# Altium project HYDRA_V4_RECOVERY.PrjPcb (part 1 of 2)
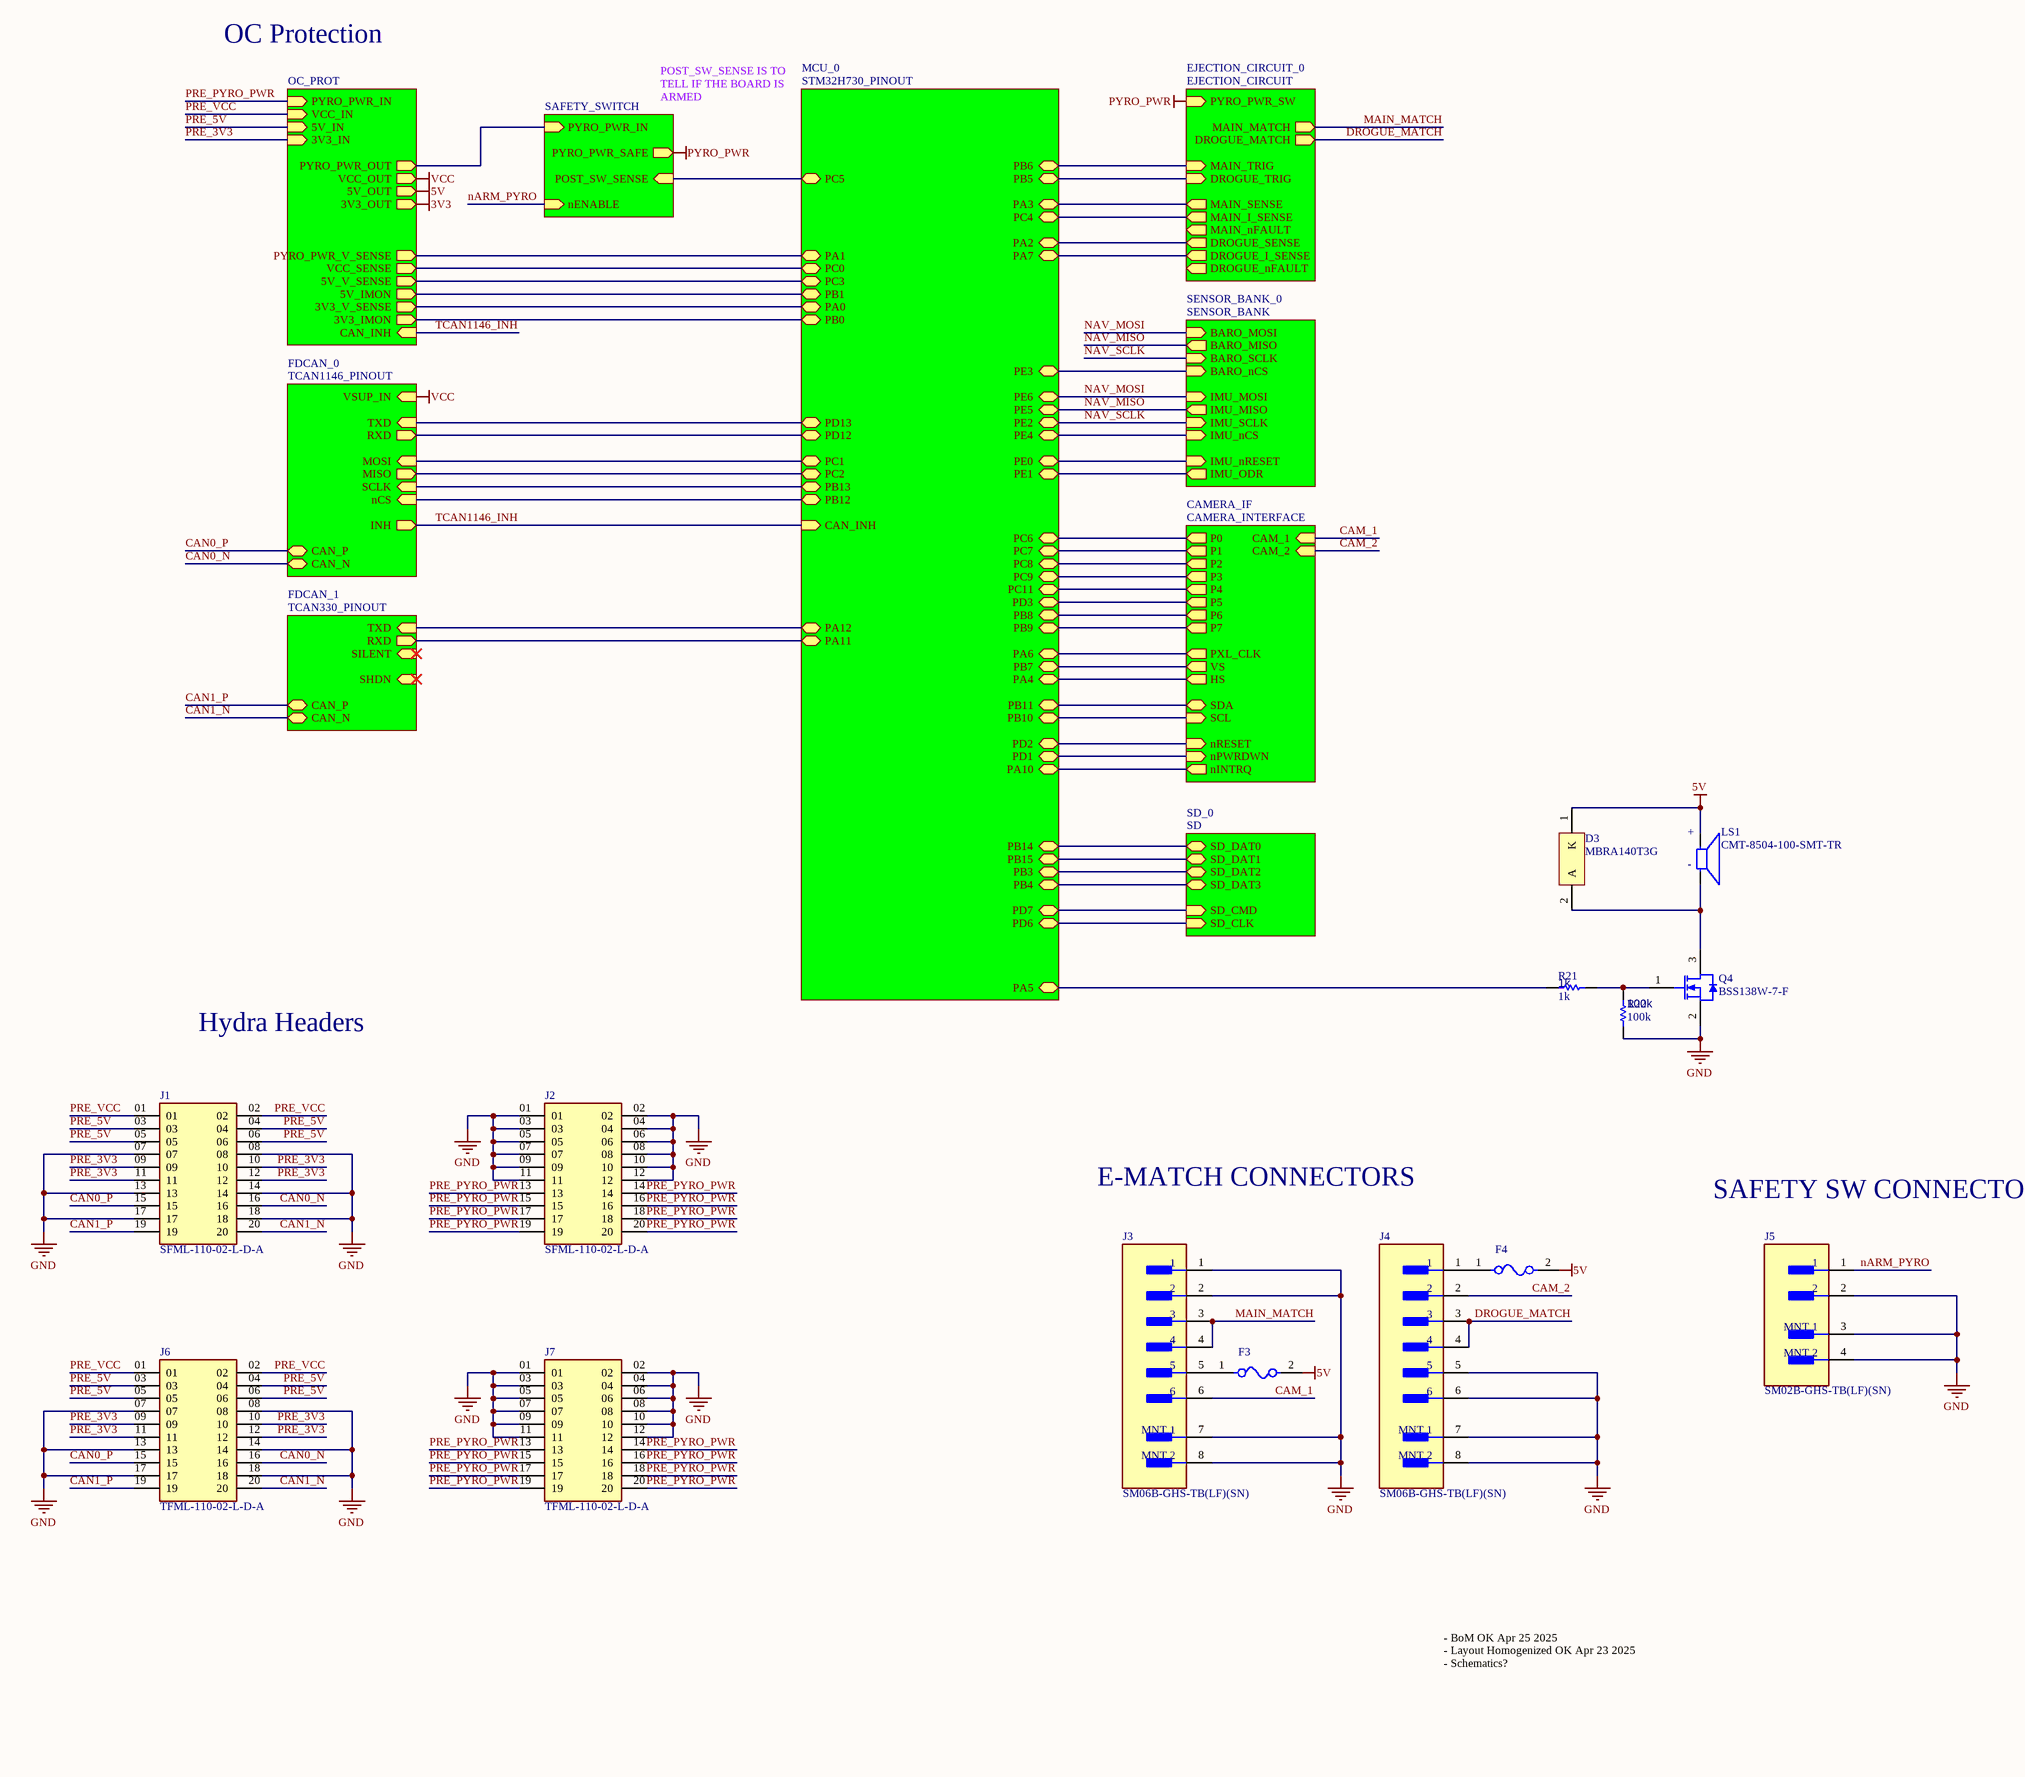
[diagram p0: HYDRA_V4_RECOVERY.SchDoc]
10 sheets, 185 parts. Net scope: hierarchical (ports join the sheet entries above them; power ports are global).
Board file: HYDRA_V4_RECOVERY.PcbDoc
Sheets:
  HYDRA_V4_RECOVERY.SchDoc
    OC_PROT = OC_PROT.SchDoc
    MCU_0 = STM32H730_PINOUT.SchDoc
    EJECTION_CIRCUIT_0 = EJECTION_CIRCUIT.SchDoc
    SENSOR_BANK_0 = SENSOR_BANK.SchDoc
    CAMERA_IF = CAMERA_INTERFACE.SchDoc
    FDCAN_1 = TCAN330_PINOUT.SchDoc
    FDCAN_0 = TCAN1146_PINOUT.SchDoc
    SAFETY_SWITCH_0 = SAFETY_SWITCH.SchDoc
    SD_0 = SD.SchDoc

## Sheet HYDRA_V4_RECOVERY.SchDoc
size C; SheetNumber: 1; SheetTotal: 10

### Parts
D3  MBRA140T3G  [ONSC-SMA-2-403D-02_V]
F3  MF-FSMF050X-2  [FP-MF-FSMF-MFG]  (value not drawn)
F4  MF-FSMF050X-2  [FP-MF-FSMF-MFG]  (value not drawn)
J1  SFML-110-02-L-D-A  [SFML-110-02-L-D-A-Footprint-1]
J2  SFML-110-02-L-D-A  [SFML-110-02-L-D-A-Footprint-1]
J3  SM06B-GHS-TB(LF)(SN)  [FP-SM06B-GHS-TB_LF_SN-MFG]
J4  SM06B-GHS-TB(LF)(SN)  [FP-SM06B-GHS-TB_LF_SN-MFG]
J5  SM02B-GHS-TB(LF)(SN)  [FP-SM02B-GHS-TB_LF_SN-MFG]
J6  TFML-110-02-L-D-A  [TFML-110-02-L-D-A-Footprint-1]
J7  TFML-110-02-L-D-A  [TFML-110-02-L-D-A-Footprint-1]
LS1  CMT-8504-100-SMT-TR  [CMT-8504-100-SMT-TR-Footprint-1]
Q4  BSS138W-7-F  [DIOD-SOT323-3_V]
R21  1k  [R0603B]
R22  100k  [R0603B]

### Sub-sheets
CAMERA_IF = CAMERA_INTERFACE: P0 (out), P1 (out), P2 (out), P3 (out), P4 (out), P5 (out), P6 (out), P7 (out), PXL_CLK (out), VS (out), HS (out), SDA (bidir), SCL (in), nRESET (in), nPWRDWN (in), CAM_1 (in), CAM_2 (in), nINTRQ (out)
EJECTION_CIRCUIT_0 = EJECTION_CIRCUIT: MAIN_TRIG (in), DROGUE_TRIG (in), PYRO_PWR_SW (in), MAIN_SENSE (out), DROGUE_SENSE (out), MAIN_I_SENSE (out), DROGUE_I_SENSE (out), MAIN_MATCH (out), DROGUE_MATCH (out), MAIN_nFAULT (out), DROGUE_nFAULT (out)
FDCAN_0 = TCAN1146_PINOUT: TXD (in), RXD (out), MOSI (in), MISO (out), SCLK (in), nCS (in), INH (out), CAN_P (bidir), CAN_N (bidir), VSUP_IN (in)
FDCAN_1 = TCAN330_PINOUT: TXD (in), RXD (out), SHDN (in), SILENT (in), CAN_P (bidir), CAN_N (bidir)
MCU_0 = STM32H730_PINOUT: CAN_INH (in), PD3 (bidir), PA4 (bidir), PA6 (bidir), PB7 (bidir), PB8 (bidir), PB9 (bidir), PC6 (bidir), PC7 (bidir), PC8 (bidir), PC9 (bidir), PC11 (bidir), PE2 (bidir), PE4 (bidir), PE5 (bidir), PE6 (bidir), PE3 (bidir), PB12 (bidir), PB13 (bidir), PB14 (bidir), PB15 (bidir), PD12 (bidir), PD13 (bidir), PA11 (bidir), PA12 (bidir), PD6 (bidir), PD7 (bidir), PB4 (bidir), PB3 (bidir), PC2 (bidir), PC1 (bidir), PB10 (bidir), PB11 (bidir), PD1 (bidir), PD2 (bidir), PE0 (bidir), PE1 (bidir), PC0 (bidir), PC3 (bidir), PA0 (bidir), PA1 (bidir), PA2 (bidir), PA3 (bidir), PB1 (bidir), PB0 (bidir), PC4 (bidir), PC5 (bidir), PB5 (bidir), PB6 (bidir), PA7 (bidir), PA5 (bidir), PA10 (bidir)
OC_PROT = OC_PROT: PYRO_PWR_IN (in), PYRO_PWR_V_SENSE (out), VCC_SENSE (out), 3V3_IMON (out), CAN_INH (in), VCC_IN (in), 5V_IN (in), 3V3_IN (in), PYRO_PWR_OUT (out), VCC_OUT (out), 5V_OUT (out), 3V3_OUT (out), 3V3_V_SENSE (out), 5V_V_SENSE (out), 5V_IMON (out)
SAFETY_SWITCH_0 = SAFETY_SWITCH: PYRO_PWR_IN (in), PYRO_PWR_SAFE (out), nENABLE (in), POST_SW_SENSE (in)
SD_0 = SD: SD_DAT0 (bidir), SD_DAT1 (bidir), SD_DAT2 (bidir), SD_DAT3 (bidir), SD_CMD (in), SD_CLK (in)
SENSOR_BANK_0 = SENSOR_BANK: IMU_MOSI (in), IMU_MISO (out), IMU_ODR (out), IMU_nCS (in), IMU_SCLK (in), IMU_nRESET (in), BARO_SCLK (in), BARO_MOSI (in), BARO_MISO (out), BARO_nCS (in)

### Nets
5V: D3.1(K) F3.2 F4.2 LS1.P ; sheet OC_PROT/5V_OUT
GND: J1.07 J1.08 J1.13 J1.14 J1.17 J1.18 J2.01 J2.02 J2.03 J2.04 J2.05 J2.06 J2.07 J2.08 J2.09 J2.10 J2.11 J2.12 J3.1 J3.2 J3.7(MNT_1) J3.8(MNT_2) J4.5 J4.6 J4.7(MNT_1) J4.8(MNT_2) J5.2 J5.3(MNT_1) J5.4(MNT_2) J6.07 J6.08 J6.13 J6.14 J6.17 J6.18 J7.01 J7.02 J7.03 J7.04 J7.05 J7.06 J7.07 J7.08 J7.09 J7.10 J7.11 J7.12 Q4.2(S) R22.2
PYRO_PWR: sheet EJECTION_CIRCUIT_0/PYRO_PWR_SW, sheet SAFETY_SWITCH_0/PYRO_PWR_SAFE  [project net PYRO_PWR_SW]
VCC: sheet OC_PROT/VCC_OUT, sheet FDCAN_0/VSUP_IN  [project net TCAN1146_VSUP]
BARO_nCS: sheet MCU_0/PE3, sheet SENSOR_BANK_0/BARO_nCS
CAM_1: J3.6 ; sheet CAMERA_IF/CAM_1
CAM_2: J4.2 ; sheet CAMERA_IF/CAM_2
CAM_SCL: sheet MCU_0/PB10, sheet CAMERA_IF/SCL
CAM_SDA: sheet MCU_0/PB11, sheet CAMERA_IF/SDA
CAN0_N: J1.16 J6.16 ; sheet FDCAN_0/CAN_N
CAN0_P: J1.15 J6.15 ; sheet FDCAN_0/CAN_P
CAN1_N: J1.20 J6.20 ; sheet FDCAN_1/CAN_N
CAN1_P: J1.19 J6.19 ; sheet FDCAN_1/CAN_P
DROGUE_I_SENSE: sheet MCU_0/PA7, sheet EJECTION_CIRCUIT_0/DROGUE_I_SENSE
DROGUE_MATCH: J4.3 J4.4 ; sheet EJECTION_CIRCUIT_0/DROGUE_MATCH
DROGUE_TRIG: sheet MCU_0/PB5, sheet EJECTION_CIRCUIT_0/DROGUE_TRIG
DROGUE_V_SENSE: sheet MCU_0/PA2, sheet EJECTION_CIRCUIT_0/DROGUE_SENSE
HS: sheet MCU_0/PA4, sheet CAMERA_IF/HS
IMU_nCS: sheet MCU_0/PE4, sheet SENSOR_BANK_0/IMU_nCS
IMU_nRESET: sheet MCU_0/PE0, sheet SENSOR_BANK_0/IMU_nRESET
IMU_ODR: sheet MCU_0/PE1, sheet SENSOR_BANK_0/IMU_ODR
LLC: sheet MCU_0/PA6, sheet CAMERA_IF/PXL_CLK
MAIN_I_SENSE: sheet MCU_0/PC4, sheet EJECTION_CIRCUIT_0/MAIN_I_SENSE
MAIN_MATCH: J3.3 J3.4 ; sheet EJECTION_CIRCUIT_0/MAIN_MATCH
MAIN_TRIG: sheet MCU_0/PB6, sheet EJECTION_CIRCUIT_0/MAIN_TRIG
MAIN_V_SENSE: sheet MCU_0/PA3, sheet EJECTION_CIRCUIT_0/MAIN_SENSE
nARM_PYRO: J5.1 ; sheet SAFETY_SWITCH_0/nENABLE
NAV_MISO: sheet MCU_0/PE5, sheet SENSOR_BANK_0/IMU_MISO, sheet SENSOR_BANK_0/BARO_MISO  [project net BARO_MISO]
NAV_MOSI: sheet MCU_0/PE6, sheet SENSOR_BANK_0/IMU_MOSI, sheet SENSOR_BANK_0/BARO_MOSI  [project net BARO_MOSI]
NAV_SCLK: sheet MCU_0/PE2, sheet SENSOR_BANK_0/IMU_SCLK, sheet SENSOR_BANK_0/BARO_SCLK  [project net BARO_SCLK]
nINTRQ: sheet MCU_0/PA10, sheet CAMERA_IF/nINTRQ
nPWRDWN: sheet MCU_0/PD1, sheet CAMERA_IF/nPWRDWN
nRESET: sheet MCU_0/PD2, sheet CAMERA_IF/nRESET
P0: sheet MCU_0/PC6, sheet CAMERA_IF/P0
P1: sheet MCU_0/PC7, sheet CAMERA_IF/P1
P2: sheet MCU_0/PC8, sheet CAMERA_IF/P2
P3: sheet MCU_0/PC9, sheet CAMERA_IF/P3
P4: sheet MCU_0/PC11, sheet CAMERA_IF/P4
P5: sheet MCU_0/PD3, sheet CAMERA_IF/P5
P6: sheet MCU_0/PB8, sheet CAMERA_IF/P6
P7: sheet MCU_0/PB9, sheet CAMERA_IF/P7
PRE_3V3: J1.09 J1.10 J1.11 J1.12 J6.09 J6.10 J6.11 J6.12 ; sheet OC_PROT/3V3_IN
PRE_5V: J1.03 J1.04 J1.05 J1.06 J6.03 J6.04 J6.05 J6.06 ; sheet OC_PROT/5V_IN
PRE_PYRO_PWR: J2.13 J2.14 J2.15 J2.16 J2.17 J2.18 J2.19 J2.20 J7.13 J7.14 J7.15 J7.16 J7.17 J7.18 J7.19 J7.20 ; sheet OC_PROT/PYRO_PWR_IN
PRE_VCC: J1.01 J1.02 J6.01 J6.02 ; sheet OC_PROT/VCC_IN
SD_CLK: sheet MCU_0/PD6, sheet SD_0/SD_CLK
SD_CMD: sheet MCU_0/PD7, sheet SD_0/SD_CMD
SD_DAT0: sheet MCU_0/PB14, sheet SD_0/SD_DAT0
SD_DAT1: sheet MCU_0/PB15, sheet SD_0/SD_DAT1
SD_DAT2: sheet MCU_0/PB3, sheet SD_0/SD_DAT2
SD_DAT3: sheet MCU_0/PB4, sheet SD_0/SD_DAT3
TCAN1146_INH: sheet OC_PROT/CAN_INH, sheet MCU_0/CAN_INH, sheet FDCAN_0/INH  [project net PRE_ZENER_CAN_INH]
VS: sheet MCU_0/PB7, sheet CAMERA_IF/VS
NetD3_2: D3.2(A) LS1.N Q4.3(D)
NetF3_1: F3.1 J3.5
NetF4_1: F4.1 J4.1
NetF7_2: sheet OC_PROT/PYRO_PWR_OUT, sheet SAFETY_SWITCH_0/PYRO_PWR_IN
NetQ4_1: Q4.1(G) R21.1 R22.1
NetR21_2: R21.2 ; sheet MCU_0/PA5
NetR23_1: sheet OC_PROT/VCC_SENSE, sheet MCU_0/PC0
NetR25_1: sheet OC_PROT/PYRO_PWR_V_SENSE, sheet MCU_0/PA1
NetR27_1: sheet OC_PROT/5V_V_SENSE, sheet MCU_0/PC3
NetR31_1: sheet OC_PROT/3V3_V_SENSE, sheet MCU_0/PA0
NetR33_1: sheet OC_PROT/3V3_IMON, sheet MCU_0/PB0
NetR41_1: sheet MCU_0/PC5, sheet SAFETY_SWITCH_0/POST_SW_SENSE
NetR79_1: sheet OC_PROT/5V_IMON, sheet MCU_0/PB1
NetU8_16: sheet MCU_0/PC1, sheet FDCAN_0/MOSI
NetU8_17: sheet MCU_0/PC2, sheet FDCAN_0/MISO
NetU8_51: sheet MCU_0/PB12, sheet FDCAN_0/nCS
NetU8_52: sheet MCU_0/PB13, sheet FDCAN_0/SCLK
NetU8_59: sheet MCU_0/PD12, sheet FDCAN_0/RXD
NetU8_60: sheet MCU_0/PD13, sheet FDCAN_0/TXD
NetU8_70: sheet MCU_0/PA11, sheet FDCAN_1/RXD
NetU8_71: sheet MCU_0/PA12, sheet FDCAN_1/TXD

### Notes on the sheet
- OC Protection
- POST_SW_SENSE IS TO TELL IF THE BOARD IS ARMED
- Hydra Headers
- E-MATCH CONNECTORS
- SAFETY SW CONNECTOR
- - BoM OK Apr 25 2025
  - Layout Homogenized OK Apr 23 2025
  - Schematics?
- (in symbol CMP-00030-00002-1) +; -

### Library data of the parts
D3 = CMP-1055-00320-1: Schottky Power Rectifier, 2-Pin SMA, Pb-Free, Tape and Reel; Manufacturer: On Semiconductor; Configuration: Single; IFSM Max (A): 30; PackageReference: SMA-2-403D-02; PackageDescription: 2-Pin Small Molded Package, J-Bend Lead, Body 2.605 x 4.315 mm; RoHS: TRUE; ComponentLink1Description: Manufacturer URL; Packing: Tape and Reel; ComponentLink3URL: http://www.onsemi.com/pub_link/Collateral/403D-02.PDF; ComponentLink2Description: Datasheet; ComponentLink2URL: http://www.onsemi.cn/pub_link/Collateral/MBRA140T3-D.PDF; DatasheetVersion: Rev. 10; ComponentLink1URL: http://www.onsemi.com/; PartNumber: MBRA140T3G; ComponentLink3Description: Package Specification; Mounting Technology: Surface Mount; PackageVersion: Rev. G, 07/2012
F3 F4 = CMP-07400-000010-1: PTC RESET FUSE 6V 500MA 0603; Manufacturer: Bourns Inc.; Trip Current: 1A; Current Rating: 40A; Hold Current: 0.5A; Resistance: 0.1-0.8Ω; Value: 0.1-0.8Ω; Trip Time: 0.1s; Mouser Description: Resettable Fuses - PPTC 6volts 40amps; Category: Fuse; Digikey Description: PTC RESET FUSE 6V 500MA 0603; Temperature: -40°C to +85°C; Device Class L3: unset; Automotive: No; RoHS: TRUE; Ambient Temperature Range High: +85°C; Device Class L2: PTC Resettable Fuses; Temperature Range High: +85°C; Voltage Rating: 6V; Package: MF-FSMF; Manufacturer Part Number: MF-FSMF050X-2; Ambient Temperature Range Low: -40°C; Lead Free: Yes; ComponentLink2Description: Datasheet; Octopart: https://octopart.com/mf-fsmf050x-2-bourns-10470804; ComponentLink2URL: https://www.bourns.com/docs/Product-Datasheets/mffsmf.pdf; Temperature Range Low: -40°C; Height: 1mm; Device Class L1: Circuit Protection
J1 J2 = CMP-002-00043-1: Board Connector, 20 Contact(s), 2 Row(s), Female, Straight, 0.05 inch Pitch, Surface Mount Terminal, Locking, Black Insulator, Socket; RoHS Compliant: Yes; Connector Type: BOARD CONNECTOR; Mounting Technology: Board
J3 J4 = CMP-002-00082-1: Conn Shrouded Header HDR 6 POS 1.25mm Solder RA Side Entry SMD T/R
J5 = CMP-002-00083-1: MCU 32-bit LPC1800 ARM Cortex M3 RISC 768KB Flash 3.3V 100-Pin TFBGA Tray
J6 J7 = CMP-002-00042-3: Board Connector, 20 Contact(s), 2 Row(s), Male, Straight, Surface Mount Terminal; Connector Type: BOARD CONNECTOR; Mounting Technology: Board; RoHS Compliant: Yes
LS1 = CMP-00030-00002-1: 8.5 mm, 5 Vo-p, 100 dB, Surface Mount (SMT), Magnetic Audio Transducer Buzzer
Q4 = CMP-2000-05968-1: N-Channel Enhancement Mode Mosfet, 50 V, 200 mA, -55 to 150 degC, 6-Pin SOT-323, RoHS, Tape and Reel; Typical Turn-Off Delay Time: 20ns; Number of Channels: 1Channel; Type: EnhancementModeFieldEffectTransistor; Brand: DiodesIncorporated; Vds - Drain-Source Breakdown Voltage: 75V; Vgs - Gate-Source Voltage: 20V; Rds On - Drain-Source Resistance: 1.4Ohms; Transistor Type: 1N-Channel; Configuration: Single; Unit Weight: 0.000212oz; Pd - Power Dissipation: 200mW; Id - Continuous Drain Current: 200mA; Forward Transconductance - Min: 0.1S; Manufacturer URL: http://www.diodes.com/; Series: BSS138; Package Description: 3-Pin Small Outline Transistor, Body 2 x 1.25 mm, Pitch 0.65 mm; Mounting Technology: SurfaceMount; Product Category: MOSFET; RoHS: True; Maximum Operating Temperature: +150C; Height: 1mm; Length: 2.2mm; Technology: Si; Width: 1.35mm; Datasheet URL: http://www.diodes.com/_files/datasheets/ds30206.pdf; Manufacturer: DiodesIncorporated; Package / Case: SOT-323-3; Typical Turn-On Delay Time: 20ns; Transistor Polarity: N-Channel; Factory Pack Quantity: 3000; Packaging: Reel; Product: MOSFETSmallSignal; Datasheet Version: Rev. 11-2, 09/2013; Package Reference: SOT323; Minimum Operating Temperature: -55C; Mounting Style: SMD/SMT; Channel Mode: Enhancement
R21 R22 = CMP-009-00002-14: Resistor
  R21: Value: 1k
  R22: Value: 100k

## Sheet OC_PROT.SchDoc
size C; SheetNumber: 3; SheetTotal: 10
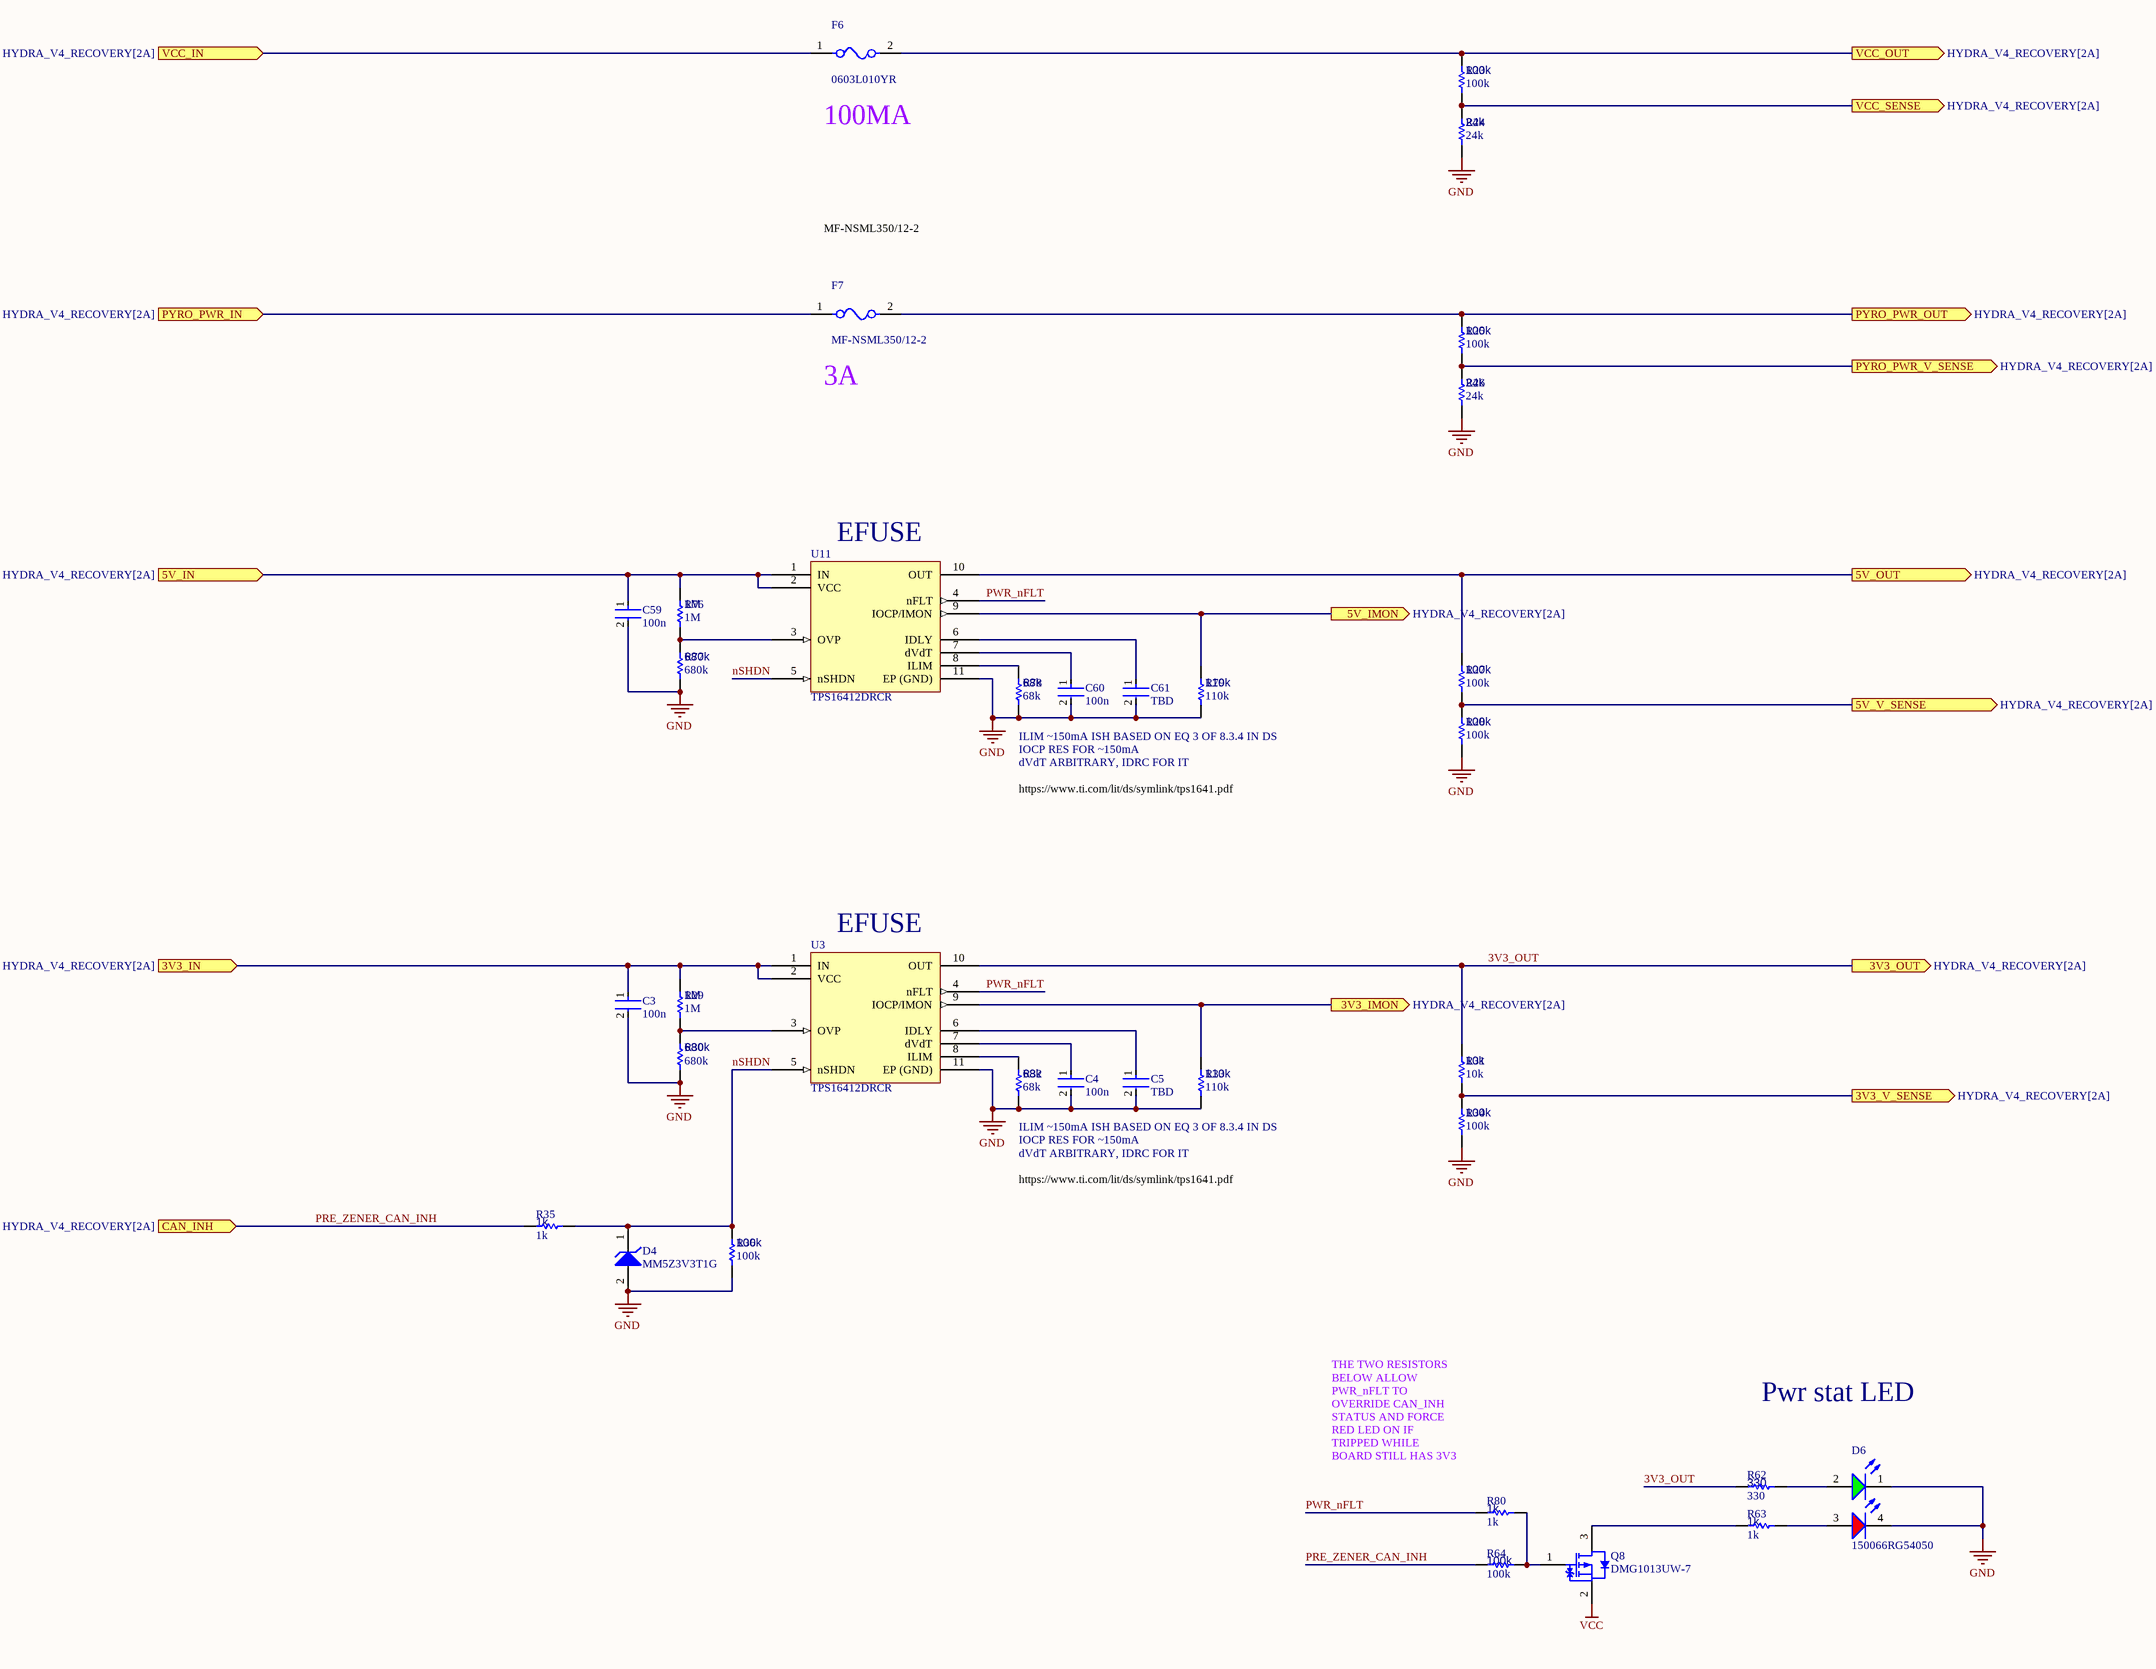
[diagram p1: OC_PROT.SchDoc]

### Parts
C3  100n  [FP-0402-L_1_0_0_05-W_0_5-IPC_A]
C4  100n  [FP-0402-L_1_0_0_05-W_0_5-IPC_A]
C5  TBD  [FP-0402-L_1_0_0_05-W_0_5-IPC_A]
C59  100n  [FP-0402-L_1_0_0_05-W_0_5-IPC_A]
C60  100n  [FP-0402-L_1_0_0_05-W_0_5-IPC_A]
C61  TBD  [FP-0402-L_1_0_0_05-W_0_5-IPC_A]
D4  MM5Z3V3T1G  [ONSC-SOD-523-2-502-01_V]
D6  150066RG54050  [WL-SBCD_0606]
F6  0603L010YR  [FP-0603L-MFG]
F7  MF-NSML350/12-2  [FP-MF-NSMF012-2-MFG]
Q8  DMG1013UW-7  [DIOD-SOT323-3_V]
R23  100k  [R0603B]
R24  24k  [R0603B]
R25  100k  [R0603B]
R26  24k  [R0603B]
R27  100k  [R0603B]
R28  100k  [R0603B]
R29  1M  [R0603B]
R30  680k  [R0603B]
R31  10k  [R0603B]
R32  68k  [R0603B]
R33  110k  [R0603B]
R34  100k  [R0603B]
R35  1k  [R0603B]
R36  100k  [R0603B]
R62  330  [R0603B]
R63  1k  [R0603B]
R64  100k  [R0603B]
R76  1M  [R0603B]
R77  680k  [R0603B]
R78  68k  [R0603B]
R79  110k  [R0603B]
R80  1k  [R0603B]
U3  TPS16412DRCR  [PSON50P300X100_HS-11N]
U11  TPS16412DRCR  [PSON50P300X100_HS-11N]

### Ports
3V3_IMON (out, see HYDRA_V4_RECOVERY[2A]), 3V3_IN (in, see HYDRA_V4_RECOVERY[2A]), 3V3_OUT (out, see HYDRA_V4_RECOVERY[2A]), 3V3_V_SENSE (out, see HYDRA_V4_RECOVERY[2A]), 5V_IMON (out, see HYDRA_V4_RECOVERY[2A]), 5V_IN (in, see HYDRA_V4_RECOVERY[2A]), 5V_OUT (out, see HYDRA_V4_RECOVERY[2A]), 5V_V_SENSE (out, see HYDRA_V4_RECOVERY[2A]), CAN_INH (in, see HYDRA_V4_RECOVERY[2A]), PYRO_PWR_IN (in, see HYDRA_V4_RECOVERY[2A]), PYRO_PWR_OUT (out, see HYDRA_V4_RECOVERY[2A]), PYRO_PWR_V_SENSE (out, see HYDRA_V4_RECOVERY[2A]), VCC_IN (in, see HYDRA_V4_RECOVERY[2A]), VCC_OUT (out, see HYDRA_V4_RECOVERY[2A]), VCC_SENSE (out, see HYDRA_V4_RECOVERY[2A])

### Nets
3V3_OUT: R31.2 R62.2 U3.10(OUT) ; port 3V3_OUT
5V: R27.2 U11.10(OUT) ; port 5V_OUT
GND: C3.2 C4.2 C5.2 C59.2 C60.2 C61.2 D4.2(A) D6.1(K) D6.4(K) R24.1 R26.1 R28.1 R30.2 R32.2 R33.2 R34.1 R36.1 R77.2 R78.2 R79.2 U3.11(EP_(GND)) U11.11(EP_(GND))
VCC: F6.2 Q8.2(S) R23.2 ; port VCC_OUT  [project net TCAN1146_VSUP]
nSHDN: D4.1(K) R35.1 R36.2 U3.5(nSHDN) U11.5(nSHDN)
PRE_3V3: C3.1 R29.1 U3.1(IN) U3.2(VCC) ; port 3V3_IN
PRE_5V: C59.1 R76.1 U11.1(IN) U11.2(VCC) ; port 5V_IN
PRE_PYRO_PWR: F7.1 ; port PYRO_PWR_IN
PRE_VCC: F6.1 ; port VCC_IN
PRE_ZENER_CAN_INH: R35.2 R64.2 ; port CAN_INH
PWR_nFLT: R80.2 U3.4(nFLT) U11.4(nFLT)
NetC4_1: C4.1 U3.7(dVdT)
NetC5_1: C5.1 U3.6(IDLY)
NetC60_1: C60.1 U11.7(dVdT)
NetC61_1: C61.1 U11.6(IDLY)
NetD6_2: D6.2(A) R62.1
NetD6_3: D6.3(A) R63.1
NetF7_2: F7.2 R25.2 ; port PYRO_PWR_OUT
NetQ8_1: Q8.1(G) R64.1 R80.1
NetQ8_3: Q8.3(D) R63.2
NetR23_1: R23.1 R24.2 ; port VCC_SENSE
NetR25_1: R25.1 R26.2 ; port PYRO_PWR_V_SENSE
NetR27_1: R27.1 R28.2 ; port 5V_V_SENSE
NetR29_2: R29.2 R30.1 U3.3(OVP)
NetR31_1: R31.1 R34.2 ; port 3V3_V_SENSE
NetR32_1: R32.1 U3.8(ILIM)
NetR33_1: R33.1 U3.9(IOCP/IMON) ; port 3V3_IMON
NetR76_2: R76.2 R77.1 U11.3(OVP)
NetR78_1: R78.1 U11.8(ILIM)
NetR79_1: R79.1 U11.9(IOCP/IMON) ; port 5V_IMON

### Notes on the sheet
- (near F6) 100MA
- MF-NSML350/12-2
- (near F7) 3A
- (near U11) EFUSE
- ILIM ~150mA ISH BASED ON EQ 3 OF 8.3.4 IN DS
- dVdT ARBITRARY, IDRC FOR IT
- IOCP RES FOR ~150mA
- https://www.ti.com/lit/ds/symlink/tps1641.pdf
- (near U3) EFUSE
- Pwr stat LED
- (near R80) THE TWO RESISTORS BELOW ALLOW PWR_nFLT TO OVERRIDE CAN_INH STATUS AND FORCE RED LED ON IF TRIPPED WHILE BOARD STILL HAS 3V3

### Library data of the parts
C3-C5 C59-C61 = CMP-001-00058-1: LARGE PADS, 0402 CAP, CHANGE COMMENT TO MATCH REAL P/N; Capacitor Type: Ceramic; Min Operating Temperature: -55°C; Mounting Technology: Surface Mount; Pins: 2; Case/Package: 0402; RoHS Compliant: Yes; Max Operating Temperature: 85°C
  C3 C4 C59 C60: Value: 100n
  C5 C61: Value: TBD
D4 = CMP-1060-00750-1: Zener Voltage Regulator, 500 mW, 2-Pin SOD-523, Pb-Free, Tape and Reel; Manufacturer: On Semiconductor; P Max (W): 0.5; VZ Typ (V): 3.3; RoHS: Pb-Free; ComponentLink2Description: Datasheet; PackageReference: SOD-523-2-502-01; DatasheetVersion: Rev. 10; ComponentLink1Description: Manufacturer URL; PackageVersion: Rev. E, 09/2010; ComponentLink3URL: http://www.onsemi.com/pub_link/Collateral/502-01.PDF; ComponentLink2URL: http://www.onsemi.cn/pub_link/Collateral/MM5Z2V4T1-D.PDF; Mounting Technology: Surface Mount; PartNumber: MM5Z3V3T1G; Packing: Tape and Reel; PackageDescription: 2-Pin SOD, Body 1.2 x 0.8 mm; ComponentLink1URL: http://www.onsemi.com/; ComponentLink3Description: Package Specification
D6 = CMP-004-00040-2: Led, Red/Grn, 180Mcd/230Mcd, 624Nm/525Nm Rohs Compliant: Yes; Source: rgled.SchLib; Component Type: Standard; Design Item ID: CMP-004-00034-2; Pins: 4
F6 = CMP-08606-000025-1: PTC RESET FUSE 15V 100MA 0603; Manufacturer: Littelfuse Inc; Value: 0.9-6Ω; Trip Time: 1s; Current Rating: 40A; Trip Current: 0.3A; Hold Current: 0.1A; Octopart: https://octopart.com/0603l010yr-littelfuse-8316166; ComponentLink2URL: https://www.littelfuse.com/~/media/electronics/datasheets/resettable_ptcs/littelfuse_ptc_0603l_datasheet.pdf.pdf; Package: 0603L; Category: Fuse; Mouser Description: Resettable Fuses - PPTC PTC 15V 0603 .100A POLY SURF MOUNT; Automotive: No; Resistance: 0.9-6Ω; Device Class L3: unset; Digikey Description: PTC RESET FUSE 15V 100MA 0603; Lead Free: Yes; Temperature: -40°C to +85°C; Ambient Temperature Range High: +85°C; ComponentLink2Description: Datasheet; RoHS: TRUE; Height: 0.75mm; Temperature Range Low: -40°C; Manufacturer Part Number: 0603L010YR; Device Class L2: PTC Resettable Fuses; Device Class L1: Circuit Protection; Temperature Range High: +85°C; Ambient Temperature Range Low: -40°C; Voltage Rating: 15V
F7 = CMP-07400-000025-1: Manufacturer Part Number: MF-NSMF012-2; Manufacturer: Bourns Inc.; Voltage Rating: 30V; Hold Current: 0.12A; Trip Time: 0.2s; Trip Current: 0.29A; Automotive Grade: Grade 3; Resistance: 1.35-8.5Ω; Current Rating: 10A; Value: 1.35-8.5Ω; Category: Fuse; Device Class L2: PTC Resettable Fuses; ComponentLink2URL: https://www.bourns.com/docs/Product-Datasheets/mfnsmf.pdf; Package: MF-NSMF012-2; Automotive: Yes; Temperature Range Low: -40°C; Lead Free: Yes; Digikey Description: PTC RESET FUSE 30V 120MA 1206; Ambient Temperature Range Low: -40°C; Ambient Temperature Range High: +85°C; RoHS: TRUE; Device Class L3: unset; Device Class L1: Circuit Protection; Mouser Description: Resettable Fuses - PPTC 0.12A 30V 1.35ohm; Octopart: https://octopart.com/mf-nsmf012-2-bourns-24569; Temperature Range High: +85°C; ComponentLink2Description: Datasheet; Height: 1.1mm; Temperature: -40°C to +85°C
Q8 = CMP-2000-06170-1: P-Channel Enhancement Mode MOSFET, 310 mW, 20 V, -55 to 150 degC, 3-Pin SOT-323, RoHS, Tape and Reel; Manufacturer: Diodes Inc; Qg Gate Charge: 0.622nC; Drain-Source On Resistance-Max: 750mO; Rated Power Dissipation: 310mW; Drain-to-Source Voltage [Vdss]: 20V; Package Reference: SOT323; Datasheet Version: Rev. 3-2, 09/2013; Package Description: 3-Pin Small Outline Transistor, Body 2 x 1.25 mm, Pitch 0.65 mm; Mounting Technology: SurfaceMount; Manufacturer URL: http://www.diodes.com/; Datasheet URL: http://www.diodes.com/_files/datasheets/ds31861.pdf; Channel Type: P-Channel
R23-R36 R62-R64 R76-R80 = CMP-009-00002-14: Resistor
  R23 R25 R27 R28 R34 R36 R64: Value: 100k
  R24 R26: Value: 24k
  R29 R76: Value: 1M
  R30 R77: Value: 680k
  R31: Value: 10k
  R32 R78: Value: 68k
  R33 R79: Value: 110k
  R35 R63 R80: Value: 1k
  R62: Value: 330
U3 U11 = CMP-019-00048-3: 2.7-V to 40-V 152-mΩ 1.8-A eFuse with output power limiting 10-VSON -40 to 125

## Sheet STM32H730_PINOUT.SchDoc
size C; SheetNumber: 7; SheetTotal: 10
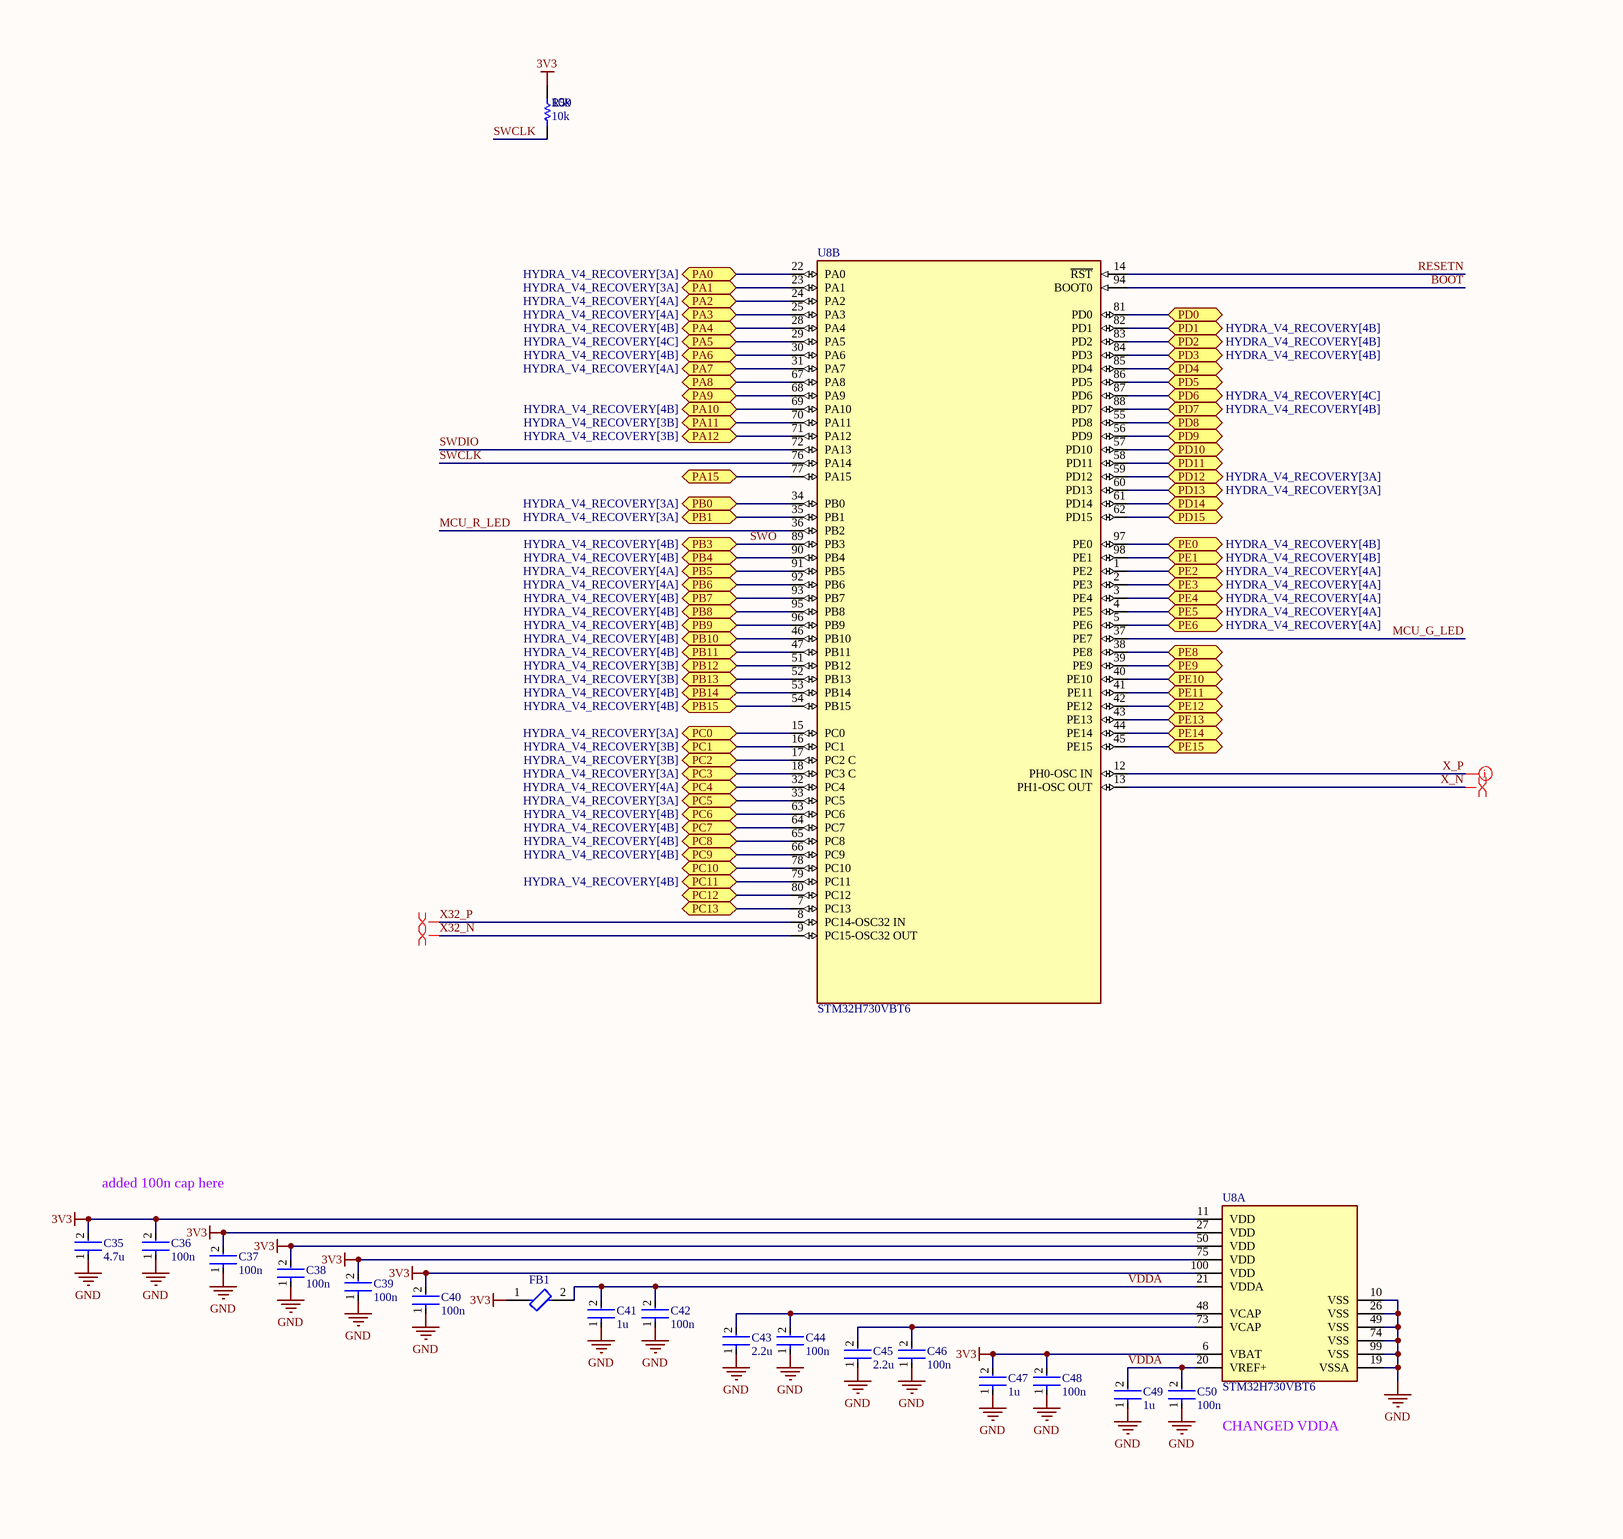
[diagram p2: STM32H730_PINOUT.SchDoc, left]
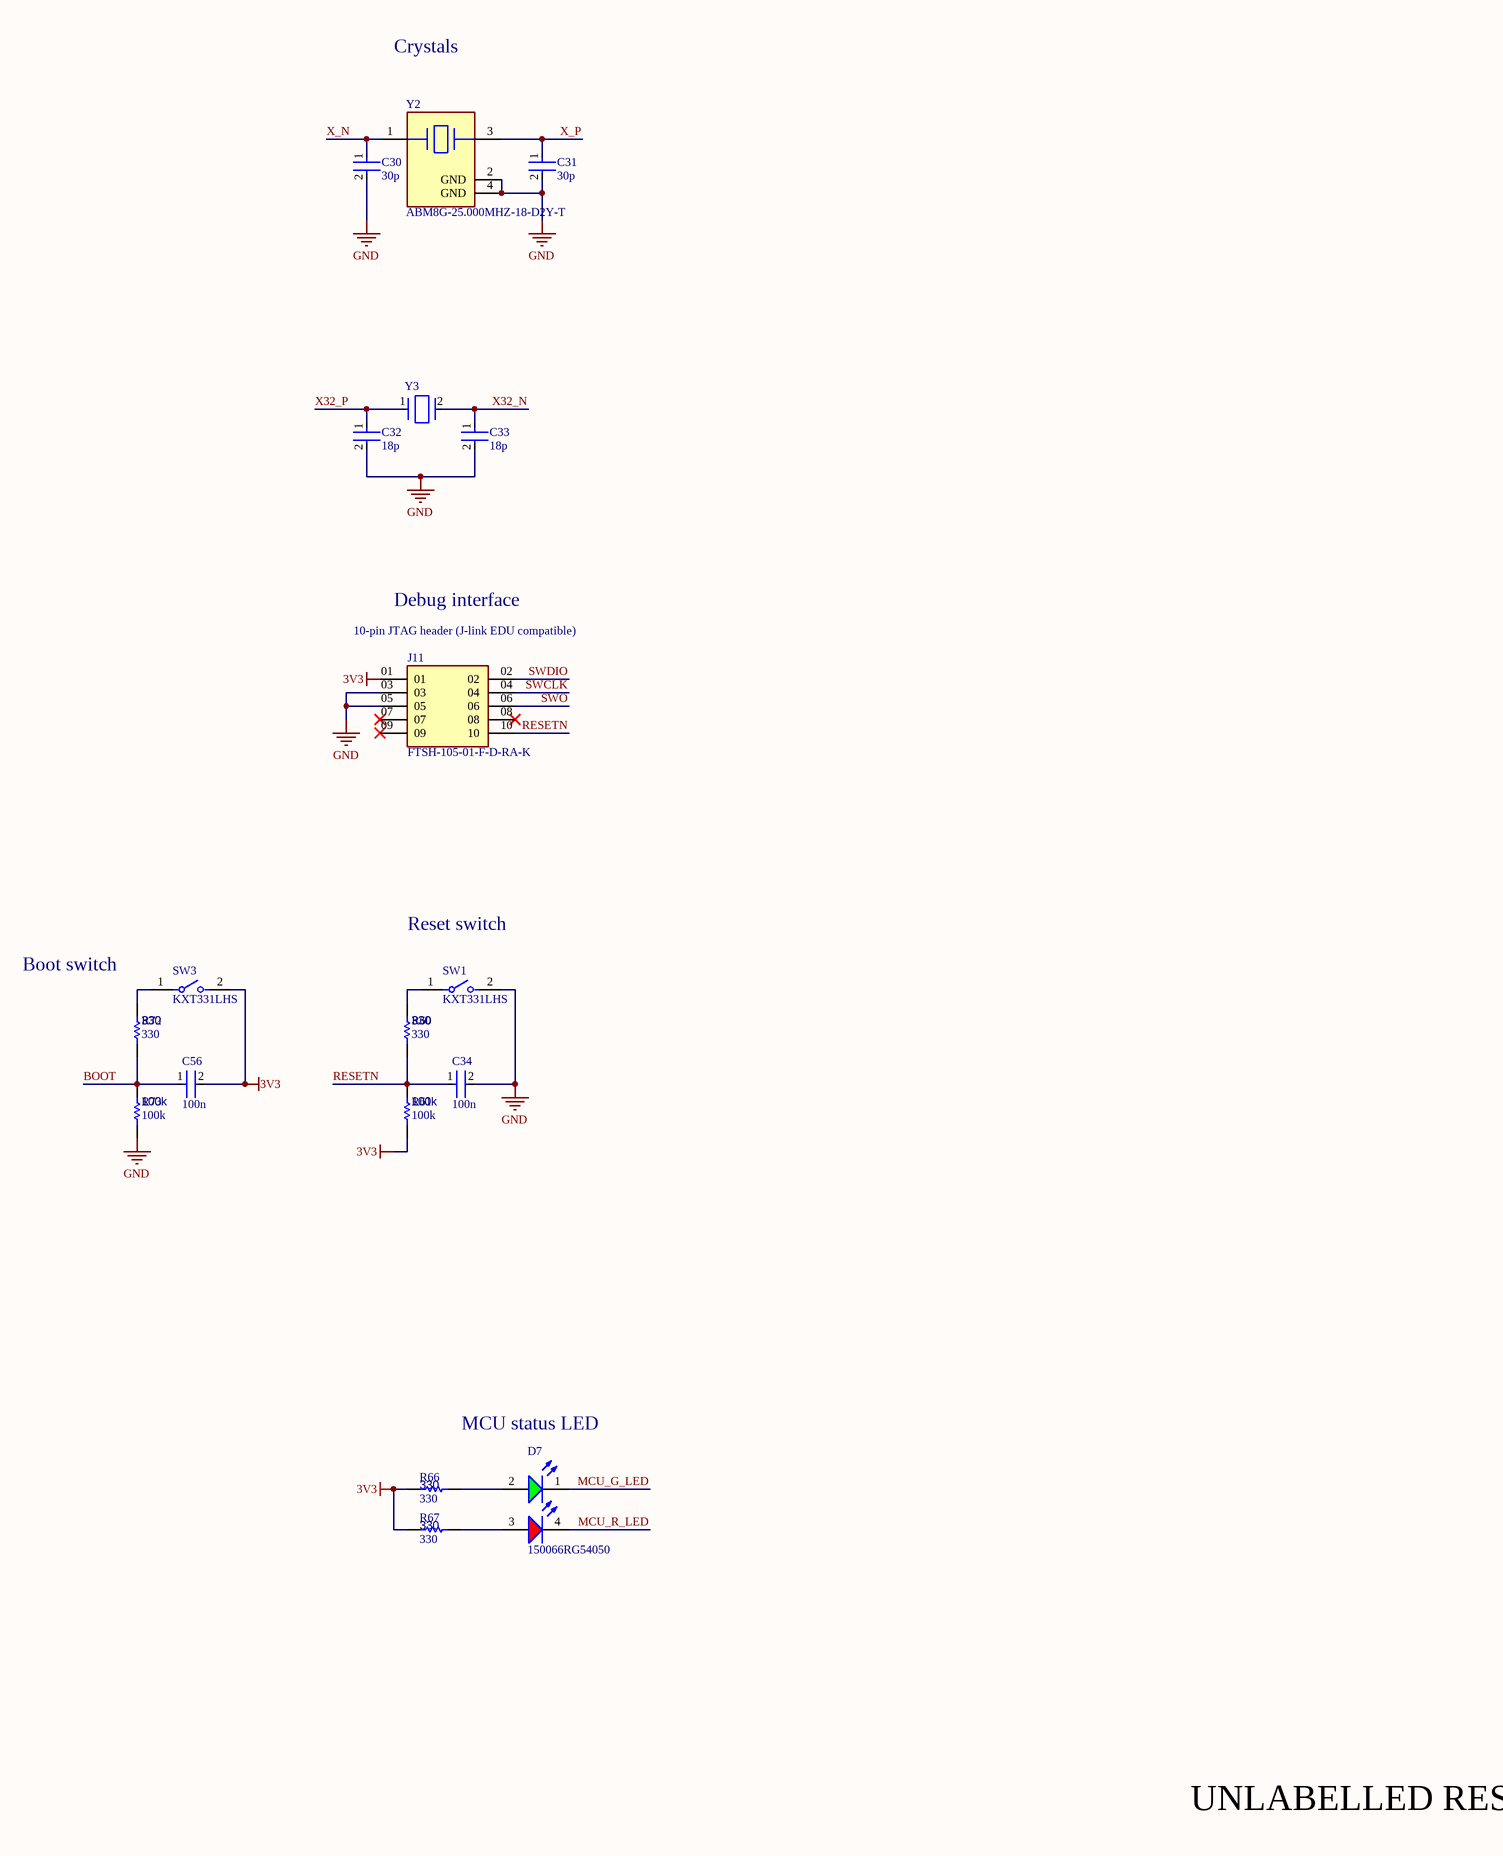
[diagram p3: STM32H730_PINOUT.SchDoc, right]

### Parts
C30  30p  [FP-0402-L_1_0_0_05-W_0_5-IPC_A]
C31  30p  [FP-0402-L_1_0_0_05-W_0_5-IPC_A]
C32  18p  [FP-0402-L_1_0_0_05-W_0_5-IPC_A]
C33  18p  [FP-0402-L_1_0_0_05-W_0_5-IPC_A]
C34  100n  [FP-0402-L_1_0_0_05-W_0_5-IPC_A]
C35  4.7u  [FP-0402-L_1_0_0_05-W_0_5-IPC_A]
C36  100n  [FP-0402-L_1_0_0_05-W_0_5-IPC_A]
C37  100n  [FP-0402-L_1_0_0_05-W_0_5-IPC_A]
C38  100n  [FP-0402-L_1_0_0_05-W_0_5-IPC_A]
C39  100n  [FP-0402-L_1_0_0_05-W_0_5-IPC_A]
C40  100n  [FP-0402-L_1_0_0_05-W_0_5-IPC_A]
C41  1u  [FP-0402-L_1_0_0_05-W_0_5-IPC_A]
C42  100n  [FP-0402-L_1_0_0_05-W_0_5-IPC_A]
C43  2.2u  [FP-0402-L_1_0_0_05-W_0_5-IPC_A]
C44  100n  [FP-0402-L_1_0_0_05-W_0_5-IPC_A]
C45  2.2u  [FP-0402-L_1_0_0_05-W_0_5-IPC_A]
C46  100n  [FP-0402-L_1_0_0_05-W_0_5-IPC_A]
C47  1u  [FP-0402-L_1_0_0_05-W_0_5-IPC_A]
C48  100n  [FP-0402-L_1_0_0_05-W_0_5-IPC_A]
C49  1u  [FP-0402-L_1_0_0_05-W_0_5-IPC_A]
C50  100n  [FP-0402-L_1_0_0_05-W_0_5-IPC_A]
C56  100n  [FP-0402-L_1_0_0_05-W_0_5-IPC_A]
D7  150066RG54050  [WL-SBCD_0606]
FB1  BLM15PX601SN1D  [FP-BLM15-0_05-MFG]  (value not drawn)
J11  FTSH-105-01-F-D-RA-K  [FTSH-105-01-F-D-RA-K-Footprint-1]
R59  10k  [R0603B]
R60  330  [R0603B]
R61  100k  [R0603B]
R66  330  [R0603B]
R67  330  [R0603B]
R72  330  [R0603B]
R73  100k  [R0603B]
SW1  KXT331LHS  [FP-KXT331LHS-MFG]
SW3  KXT331LHS  [FP-KXT331LHS-MFG]
U8  STM32H730VBT6  [FP-LQFP100-1L-IPC_C]  (parts A,B of 2)
Y2  ABM8G-25.000MHZ-18-D2Y-T  [FP-ABM8G-MFG]
Y3  ECS-.327-12.5-1210-TR  [FP-ECX-1210-MFG]  (value not drawn)

### Ports
PA0 (bidir, see HYDRA_V4_RECOVERY[3A]), PA1 (bidir, see HYDRA_V4_RECOVERY[3A]), PA2 (bidir, see HYDRA_V4_RECOVERY[4A]), PA3 (bidir, see HYDRA_V4_RECOVERY[4A]), PA4 (bidir, see HYDRA_V4_RECOVERY[4B]), PA5 (bidir, see HYDRA_V4_RECOVERY[4C]), PA6 (bidir, see HYDRA_V4_RECOVERY[4B]), PA7 (bidir, see HYDRA_V4_RECOVERY[4A]), PA8 (bidir), PA9 (bidir), PA10 (bidir, see HYDRA_V4_RECOVERY[4B]), PA11 (bidir, see HYDRA_V4_RECOVERY[3B]), PA12 (bidir, see HYDRA_V4_RECOVERY[3B]), PA15 (bidir), PB0 (bidir, see HYDRA_V4_RECOVERY[3A]), PB1 (bidir, see HYDRA_V4_RECOVERY[3A]), PB3 (bidir, see HYDRA_V4_RECOVERY[4B]), PB4 (bidir, see HYDRA_V4_RECOVERY[4B]), PB5 (bidir, see HYDRA_V4_RECOVERY[4A]), PB6 (bidir, see HYDRA_V4_RECOVERY[4A]), PB7 (bidir, see HYDRA_V4_RECOVERY[4B]), PB8 (bidir, see HYDRA_V4_RECOVERY[4B]), PB9 (bidir, see HYDRA_V4_RECOVERY[4B]), PB10 (bidir, see HYDRA_V4_RECOVERY[4B]), PB11 (bidir, see HYDRA_V4_RECOVERY[4B]), PB12 (bidir, see HYDRA_V4_RECOVERY[3B]), PB13 (bidir, see HYDRA_V4_RECOVERY[3B]), PB14 (bidir, see HYDRA_V4_RECOVERY[4B]), PB15 (bidir, see HYDRA_V4_RECOVERY[4B]), PC0 (bidir, see HYDRA_V4_RECOVERY[3A]), PC1 (bidir, see HYDRA_V4_RECOVERY[3B]), PC2 (bidir, see HYDRA_V4_RECOVERY[3B]), PC3 (bidir, see HYDRA_V4_RECOVERY[3A]), PC4 (bidir, see HYDRA_V4_RECOVERY[4A]), PC5 (bidir, see HYDRA_V4_RECOVERY[3A]), PC6 (bidir, see HYDRA_V4_RECOVERY[4B]), PC7 (bidir, see HYDRA_V4_RECOVERY[4B]), PC8 (bidir, see HYDRA_V4_RECOVERY[4B]), PC9 (bidir, see HYDRA_V4_RECOVERY[4B]), PC10 (bidir), PC11 (bidir, see HYDRA_V4_RECOVERY[4B]), PC12 (bidir), PC13 (bidir), PD0 (bidir), PD1 (bidir, see HYDRA_V4_RECOVERY[4B]), PD2 (bidir, see HYDRA_V4_RECOVERY[4B]), PD3 (bidir, see HYDRA_V4_RECOVERY[4B]), PD4 (bidir), PD5 (bidir), PD6 (bidir, see HYDRA_V4_RECOVERY[4C]), PD7 (bidir, see HYDRA_V4_RECOVERY[4B]), PD8 (bidir), PD9 (bidir), PD10 (bidir), PD11 (bidir), PD12 (bidir, see HYDRA_V4_RECOVERY[3A]), PD13 (bidir, see HYDRA_V4_RECOVERY[3A]), PD14 (bidir), PD15 (bidir), PE0 (bidir, see HYDRA_V4_RECOVERY[4B]), PE1 (bidir, see HYDRA_V4_RECOVERY[4B]), PE2 (bidir, see HYDRA_V4_RECOVERY[4A]), PE3 (bidir, see HYDRA_V4_RECOVERY[4A]), PE4 (bidir, see HYDRA_V4_RECOVERY[4A]), PE5 (bidir, see HYDRA_V4_RECOVERY[4A]), PE6 (bidir, see HYDRA_V4_RECOVERY[4A]), PE8 (bidir), PE9 (bidir), PE10 (bidir), PE11 (bidir), PE12 (bidir), PE13 (bidir), PE14 (bidir), PE15 (bidir)

### Nets
3V3: C35.2 C36.2 C37.2 C38.2 C39.2 C40.2 C47.2 C48.2 C56.2 FB1.1 J11.01 R59.2 R61.1 R66.2 R67.2 SW3.2 U8.6(VBAT) U8.11(VDD) U8.27(VDD) U8.50(VDD) U8.75(VDD) U8.100(VDD)  [project net 3V3_OUT]
GND: C30.2 C31.2 C32.2 C33.2 C34.2 C35.1 C36.1 C37.1 C38.1 C39.1 C40.1 C41.1 C42.1 C43.1 C44.1 C45.1 C46.1 C47.1 C48.1 C49.1 C50.1 J11.03 J11.05 R73.1 SW1.2 U8.10(VSS) U8.19(VSSA) U8.26(VSS) U8.49(VSS) U8.74(VSS) U8.99(VSS) Y2.2(GND) Y2.4(GND)
BARO_MISO: U8.4(PE5) ; port PE5
BARO_MOSI: U8.5(PE6) ; port PE6
BARO_nCS: U8.2(PE3) ; port PE3
BARO_SCLK: U8.1(PE2) ; port PE2
BOOT: C56.1 R72.2 R73.2 U8.94(BOOT0)
CAM_SCL: U8.46(PB10) ; port PB10
CAM_SDA: U8.47(PB11) ; port PB11
DROGUE_I_SENSE: U8.31(PA7) ; port PA7
DROGUE_TRIG: U8.91(PB5) ; port PB5
DROGUE_V_SENSE: U8.24(PA2) ; port PA2
HS: U8.28(PA4) ; port PA4
IMU_nCS: U8.3(PE4) ; port PE4
IMU_nRESET: U8.97(PE0) ; port PE0
IMU_ODR: U8.98(PE1) ; port PE1
LLC: U8.30(PA6) ; port PA6
MAIN_I_SENSE: U8.32(PC4) ; port PC4
MAIN_TRIG: U8.92(PB6) ; port PB6
MAIN_V_SENSE: U8.25(PA3) ; port PA3
MCU_G_LED: D7.1(K) U8.37(PE7)
MCU_R_LED: D7.4(K) U8.36(PB2)
nINTRQ: U8.69(PA10) ; port PA10
nPWRDWN: U8.82(PD1) ; port PD1
nRESET: U8.83(PD2) ; port PD2
P0: U8.63(PC6) ; port PC6
P1: U8.64(PC7) ; port PC7
P2: U8.65(PC8) ; port PC8
P3: U8.66(PC9) ; port PC9
P4: U8.79(PC11) ; port PC11
P5: U8.84(PD3) ; port PD3
P6: U8.95(PB8) ; port PB8
P7: U8.96(PB9) ; port PB9
RESETN: C34.1 J11.10 R60.1 R61.2 U8.14(~{RST})
SD_CLK: U8.87(PD6) ; port PD6
SD_CMD: U8.88(PD7) ; port PD7
SD_DAT0: U8.53(PB14) ; port PB14
SD_DAT1: U8.54(PB15) ; port PB15
SD_DAT3: U8.90(PB4) ; port PB4
SWCLK: J11.04 R59.1 U8.76(PA14)
SWDIO: J11.02 U8.72(PA13)
SWO: J11.06 U8.89(PB3) ; port PB3  [project net SD_DAT2]
VDDA: C41.2 C42.2 C49.2 C50.2 FB1.2 U8.20(VREF+) U8.21(VDDA)
VS: U8.93(PB7) ; port PB7
X32_N: C33.1 U8.9(PC15-OSC32_OUT) Y3.2(Out/In)
X32_P: C32.1 U8.8(PC14-OSC32_IN) Y3.1(In/Out)
X_N: C30.1 U8.13(PH1-OSC_OUT) Y2.1
X_P: C31.1 U8.12(PH0-OSC_IN) Y2.3
NetC43_2: C43.2 C44.2 U8.48(VCAP)
NetC45_2: C45.2 C46.2 U8.73(VCAP)
NetD7_2: D7.2(A) R66.1
NetD7_3: D7.3(A) R67.1
NetR21_2: U8.29(PA5) ; port PA5
NetR23_1: U8.15(PC0) ; port PC0
NetR25_1: U8.23(PA1) ; port PA1
NetR27_1: U8.18(PC3_C) ; port PC3
NetR31_1: U8.22(PA0) ; port PA0
NetR33_1: U8.34(PB0) ; port PB0
NetR41_1: U8.33(PC5) ; port PC5
NetR60_2: R60.2 SW1.1
NetR72_1: R72.1 SW3.1
NetR79_1: U8.35(PB1) ; port PB1
NetU8_7: U8.7(PC13) ; port PC13
NetU8_16: U8.16(PC1) ; port PC1
NetU8_17: U8.17(PC2_C) ; port PC2
NetU8_38: U8.38(PE8) ; port PE8
NetU8_39: U8.39(PE9) ; port PE9
NetU8_40: U8.40(PE10) ; port PE10
NetU8_41: U8.41(PE11) ; port PE11
NetU8_42: U8.42(PE12) ; port PE12
NetU8_43: U8.43(PE13) ; port PE13
NetU8_44: U8.44(PE14) ; port PE14
NetU8_45: U8.45(PE15) ; port PE15
NetU8_51: U8.51(PB12) ; port PB12
NetU8_52: U8.52(PB13) ; port PB13
NetU8_55: U8.55(PD8) ; port PD8
NetU8_56: U8.56(PD9) ; port PD9
NetU8_57: U8.57(PD10) ; port PD10
NetU8_58: U8.58(PD11) ; port PD11
NetU8_59: U8.59(PD12) ; port PD12
NetU8_60: U8.60(PD13) ; port PD13
NetU8_61: U8.61(PD14) ; port PD14
NetU8_62: U8.62(PD15) ; port PD15
NetU8_67: U8.67(PA8) ; port PA8
NetU8_68: U8.68(PA9) ; port PA9
NetU8_70: U8.70(PA11) ; port PA11
NetU8_71: U8.71(PA12) ; port PA12
NetU8_77: U8.77(PA15) ; port PA15
NetU8_78: U8.78(PC10) ; port PC10
NetU8_80: U8.80(PC12) ; port PC12
NetU8_81: U8.81(PD0) ; port PD0
NetU8_85: U8.85(PD4) ; port PD4
NetU8_86: U8.86(PD5) ; port PD5

Not connected (* = marked no-connect by the designer): J11 07* 08* 09*

### Layout directives
differential pair: X32_N, X32_P, X_N, X_P

### Notes on the sheet
- Crystals
- (near J11) 10-pin JTAG header (J-link EDU compatible)
- Debug interface
- Boot switch
- Reset switch
- added 100n cap here
- CHANGED VDDA
- MCU status LED
- UNLABELLED RESISTORS ARE JUMPERS

### Library data of the parts
C30-C50 C56 = CMP-001-00058-1: as C3 on sheet OC_PROT; Min Operating Temperature: -55°C; Mounting Technology: Surface Mount; Pins: 2; Case/Package: 0402; RoHS Compliant: Yes; Max Operating Temperature: 85°C
  C30 C31: Value: 30p
  C32 C33: Value: 18p
  C34 C36-C40 C42 C44 C46 C48 C50 C56: Value: 100n
  C35: Value: 4.7u
  C41 C47 C49: Value: 1u
  C43 C45: Value: 2.2u
D7 = CMP-004-00040-2: as D6 on sheet OC_PROT; Source: rgled.SchLib; Component Type: Standard; Design Item ID: CMP-004-00034-2; Pins: 4
FB1 = CMP-0686-00252-4: Chip Ferrite Bead, 0402, 600Ω @ 100MHz, 0.23Ω, 25%, 900mA; Number of Circuits: 1; Impedance: 600R; DC Resistance (DCR): 230mR; Material: Steel; Length: 1mm; Package Quantity: 10000; Height: 0.5mm; Width: 0.5mm; Max DC Current: 900mA; Number of Lines: 1; Termination: SMD/SMT; Packaging: Tape and Reel; Lead Free: Lead Free; Min Operating Temperature: -55°C; Max Operating Temperature: 125°C; Max Current Rating: 900mA; Case Code (Imperial): 0402; Number of Pins: 2; Current Rating: 900mA; Test Frequency: 100MHz; Case/Package: 0402; Tolerance: 25%; Case Code (Metric): 1005
J11 = CMP-002-00041-5: Board Connector, 10 Contact(s), 2 Row(s), Male, Right Angle, 0.05 inch Pitch, Surface Mount Terminal, Locking, Black Insulator; Connector Type: BOARD CONNECTOR; Mounting Technology: Board; RoHS Compliant: Yes
R59-R61 R66 R67 R72 R73 = CMP-009-00002-14: Resistor
  R59: Value: 10k
  R60 R66 R67 R72: Value: 330
  R61 R73: Value: 100k
SW1 SW3 = CMP-10040-000029-1: SWITCH TACTILE SPST-NO 0.02A 15V; Operating Force: 240gf; Switch Travel: 0.13mm; Illumination Type: Non-Illuminated; Throw Configuration: SPST; Number of Ports: 1; Current Rating: 5A; Mechanical Life: 500000Cycles; Switch Function: Off-Mom; Connector Type: USB; Actuator Type: Standard; Gender: Receptacle; Number of Contacts: 24; Contact Plating: Gold; Insulation Color: Black; Min Operating Temperature: -40°C; Packaging: Tape and Reel; Flammability Rating: UL94 V-0; Max Operating Temperature: 85°C; Termination: Solder; Mount: Surface Mount
U8 = CMP-12105-000107-1: IC MCU 32BIT 128KB FLASH 100LQFP
Y2 = CMP-2000-05733-3: Crystal 25MHz ±20ppm (Tol) ±30ppm (Stability) 18pF FUND 60Ω 4-Pin SMD T/R; Series Resistance: 60R; Length: 3.2mm; Depth: 2.5mm; Packaging: Tape and Reel; Min Operating Temperature: -40°C; Operating Frequency: 25 MHz; Lead Free: Lead Free; Number of Pins: 4; Frequency Tolerance: 20ppm; Radiation Hardening: No; Max Operating Temperature: 85°C; Termination: SMD/SMT; Frequency Stability: 30ppm; Frequency: 25MHz; Series: ABM8G; Mount: Surface Mount; Package Quantity: 1000; Height: 0.039inch; Width: 0.098inch; Case/Package: CSMD; ESR (Equivalent Series Resistance): 60R; Load Capacitance: 18pF; Tolerance: 20ppm
Y3 = CMP-40224-000006-1: CRYSTAL 32.7680KHZ 12.5PF SMD; Manufacturer: ECS International; Frequency: 32.768kHz; Esr: 90kΩ; Tolerance: 20ppm; Device Class L1: Passive Components; Load Capacitance: 12.5pF; Temperature: -40°C to +85°C; ComponentLink2URL: https://ecsxtal.com/store/pdf/ECX-1210.pdf; Series: ECX-1210; Octopart: https://octopart.com/ecs-.327-12.5-1210-tr-ecs+international-81221340; ComponentLink2Description: Datasheet; Temperature Range Low: -40°C; Digikey Description: CRYSTAL 32.7680KHZ 12.5PF SMD; Lead Free: Yes; RoHS: TRUE; Device Class L3: Crystals; Automotive: No; Category: Crys; Height: 0.5mm; Manufacturer Part Number: ECS-.327-12.5-1210-TR; Temperature Range High: +85°C; Device Class L2: Crystals / Oscillators; Package: ECX-1210

## Sheet EJECTION_CIRCUIT.SchDoc
size B; SheetNumber: 2; SheetTotal: 10
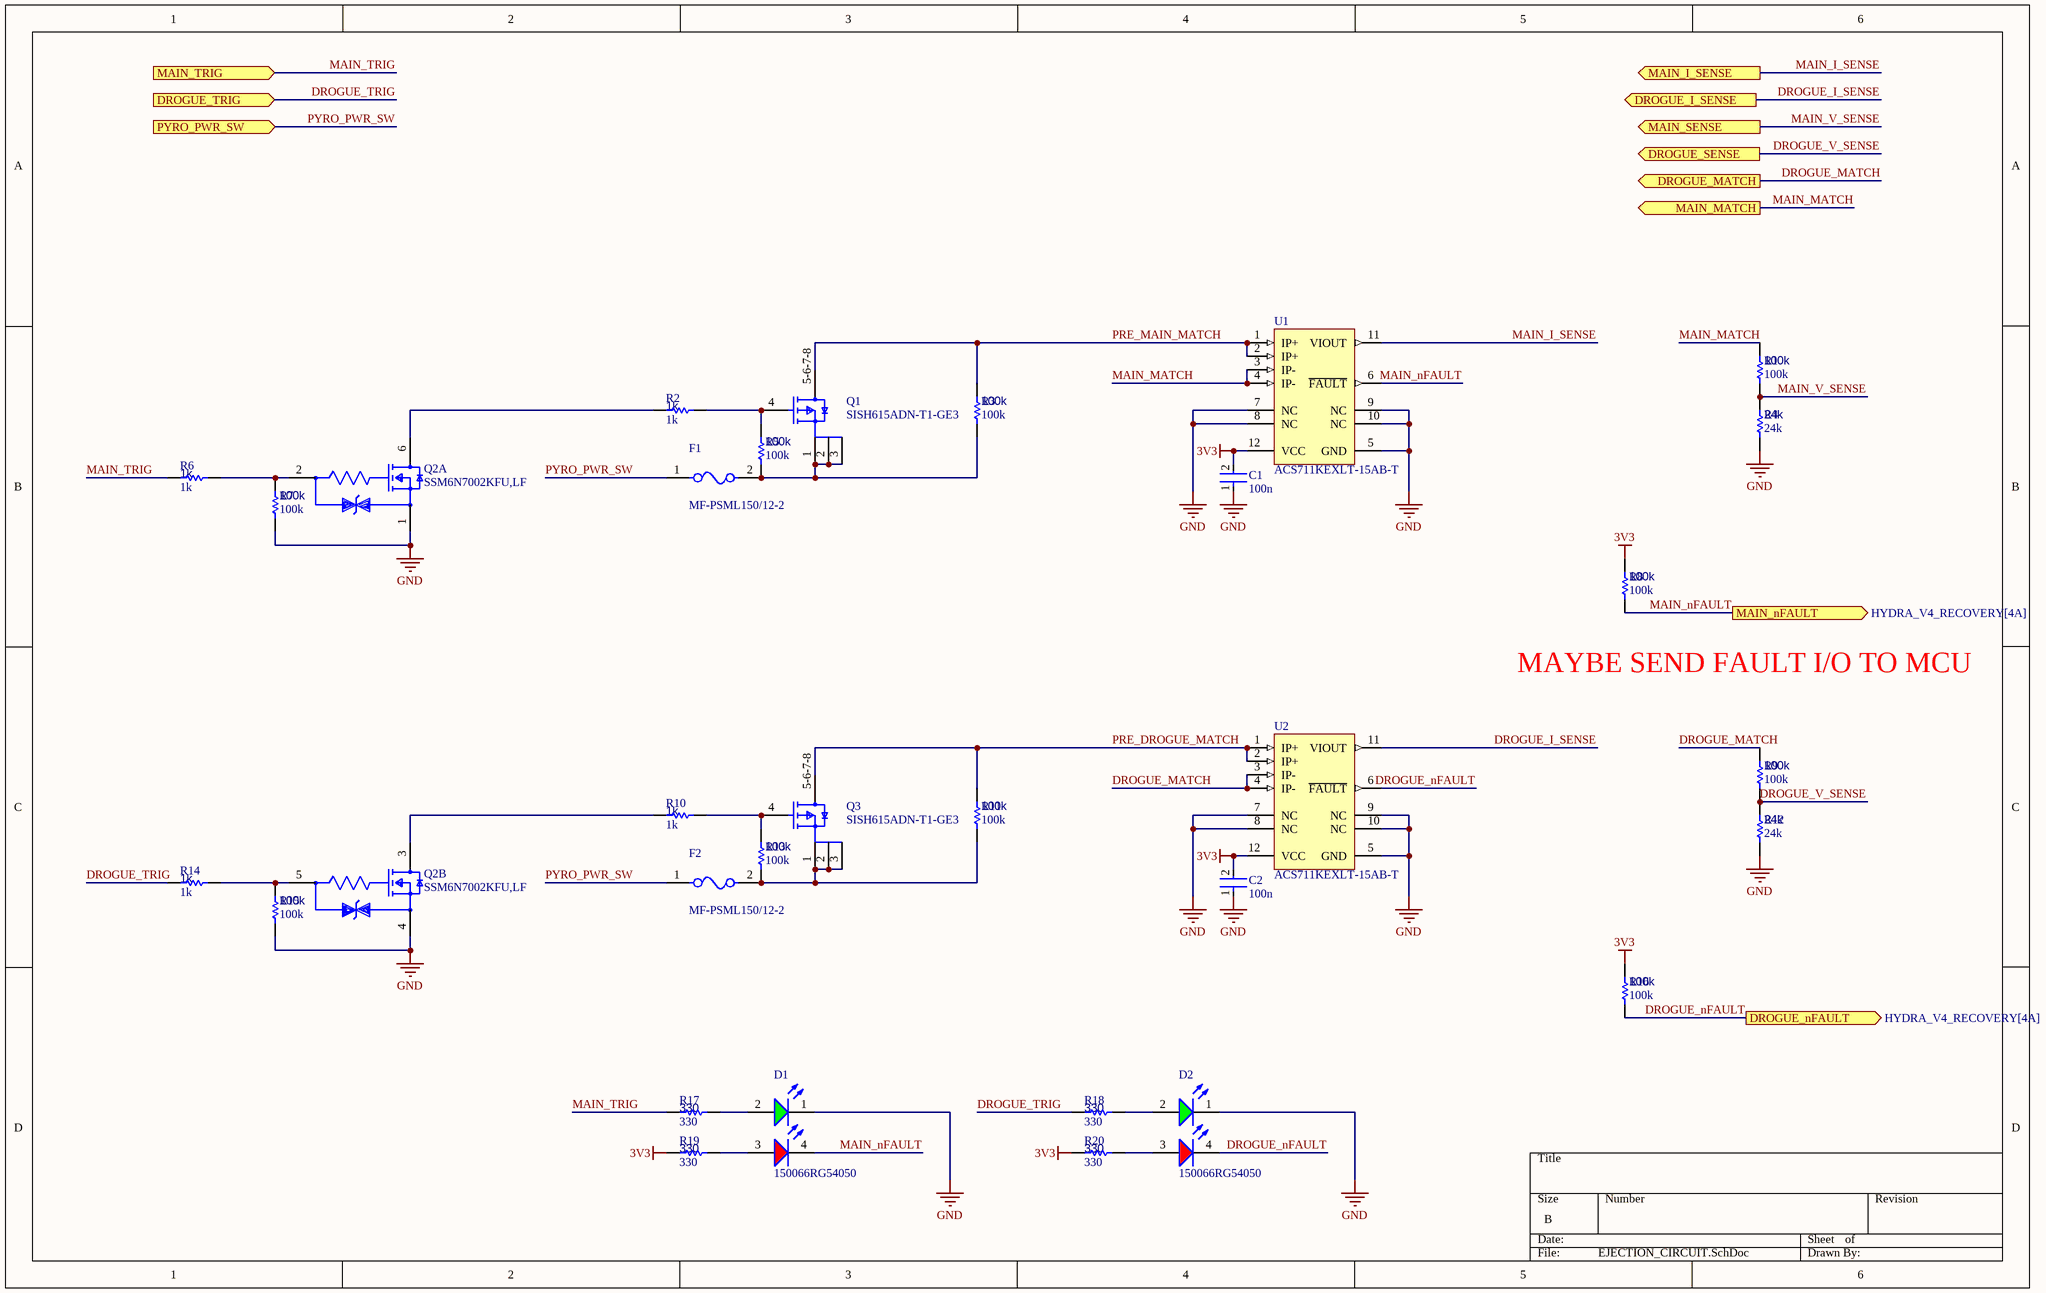
[diagram p4: EJECTION_CIRCUIT.SchDoc]

### Parts
C1  100n  [FP-0402-L_1_0_0_05-W_0_5-IPC_A]
C2  100n  [FP-0402-L_1_0_0_05-W_0_5-IPC_A]
D1  150066RG54050  [WL-SBCD_0606]
D2  150066RG54050  [WL-SBCD_0606]
F1  MF-PSML150/12-2  [FP-MF-PSMF-MFG]
F2  MF-PSML150/12-2  [FP-MF-PSMF-MFG]
Q1  SISH615ADN-T1-GE3  [SISH615ADN-T1-GE3-Footprint-1]
Q2  SSM6N7002KFU,LF  [FP-SSOP6-P-0_65A-MFG]  (parts A,B of 2)
Q3  SISH615ADN-T1-GE3  [SISH615ADN-T1-GE3-Footprint-1]
R1  100k  [R0603B]
R2  1k  [R0603B]
R3  100k  [R0603B]
R4  24k  [R0603B]
R5  100k  [R0603B]
R6  1k  [R0603B]
R7  100k  [R0603B]
R8  100k  [R0603B]
R9  100k  [R0603B]
R10  1k  [R0603B]
R11  100k  [R0603B]
R12  24k  [R0603B]
R13  100k  [R0603B]
R14  1k  [R0603B]
R15  100k  [R0603B]
R16  100k  [R0603B]
R17  330  [R0603B]
R18  330  [R0603B]
R19  330  [R0603B]
R20  330  [R0603B]
U1  ACS711KEXLT-15AB-T  [ALEG-EX-12_V]
U2  ACS711KEXLT-15AB-T  [ALEG-EX-12_V]

### Ports
DROGUE_I_SENSE (out, see HYDRA_V4_RECOVERY[4A]), DROGUE_MATCH (out, see HYDRA_V4_RECOVERY[4A]), DROGUE_nFAULT (out, see HYDRA_V4_RECOVERY[4A]), DROGUE_SENSE (out, see HYDRA_V4_RECOVERY[4A]), DROGUE_TRIG (in, see HYDRA_V4_RECOVERY[4A]), MAIN_I_SENSE (out, see HYDRA_V4_RECOVERY[4A]), MAIN_MATCH (out, see HYDRA_V4_RECOVERY[4A]), MAIN_nFAULT (out, see HYDRA_V4_RECOVERY[4A]), MAIN_SENSE (out, see HYDRA_V4_RECOVERY[4A]), MAIN_TRIG (in, see HYDRA_V4_RECOVERY[4A]), PYRO_PWR_SW (in, see HYDRA_V4_RECOVERY[4A])

### Nets
3V3: C1.2 C2.2 R8.2 R16.2 R19.2 R20.2 U1.12(VCC) U2.12(VCC)  [project net 3V3_OUT]
GND: C1.1 C2.1 D1.1(K) D2.1(K) Q2.1(Source1) Q2.4(Source2) R4.1 R7.1 R12.1 R15.1 U1.5(GND) U1.7(NC) U1.8(NC) U1.9(NC) U1.10(NC) U2.5(GND) U2.7(NC) U2.8(NC) U2.9(NC) U2.10(NC)
PYRO_PWR_SW: F1.1 F2.1 ; port PYRO_PWR_SW
DROGUE_I_SENSE: U2.11(VIOUT) ; port DROGUE_I_SENSE
DROGUE_MATCH: R9.2 U2.3(IP-) U2.4(IP-) ; port DROGUE_MATCH
DROGUE_nFAULT: D2.4(K) R16.1 U2.6(~{FAULT}) ; port DROGUE_nFAULT
DROGUE_TRIG: R14.2 R18.2 ; port DROGUE_TRIG
DROGUE_V_SENSE: R9.1 R12.2 ; port DROGUE_SENSE
MAIN_I_SENSE: U1.11(VIOUT) ; port MAIN_I_SENSE
MAIN_MATCH: R1.2 U1.3(IP-) U1.4(IP-) ; port MAIN_MATCH
MAIN_nFAULT: D1.4(K) R8.1 U1.6(~{FAULT}) ; port MAIN_nFAULT
MAIN_TRIG: R6.2 R17.2 ; port MAIN_TRIG
MAIN_V_SENSE: R1.1 R4.2 ; port MAIN_SENSE
PRE_DROGUE_MATCH: Q3.5-6-7-8(D) R11.2 U2.1(IP+) U2.2(IP+)
PRE_MAIN_MATCH: Q1.5-6-7-8(D) R3.2 U1.1(IP+) U1.2(IP+)
NetD1_2: D1.2(A) R17.1
NetD1_3: D1.3(A) R19.1
NetD2_2: D2.2(A) R18.1
NetD2_3: D2.3(A) R20.1
NetF1_2: F1.2 Q1.1(S) Q1.2(S) Q1.3(S) R3.1 R5.1
NetF2_2: F2.2 Q3.1(S) Q3.2(S) Q3.3(S) R11.1 R13.1
NetQ1_4: Q1.4(G) R2.1 R5.2
NetQ2_2: Q2.2(Gate1) R6.1 R7.2
NetQ2_3: Q2.3(Drain2) R10.2
NetQ2_5: Q2.5(Gate2) R14.1 R15.2
NetQ2_6: Q2.6(Drain1) R2.2
NetQ3_4: Q3.4(G) R10.1 R13.2

### Notes on the sheet
- (near R8) MAYBE SEND FAULT I/O TO MCU

### Library data of the parts
C1 C2 = CMP-001-00058-1: as C3 on sheet OC_PROT; Value: 100n; Min Operating Temperature: -55°C; Mounting Technology: Surface Mount; Pins: 2; Case/Package: 0402; RoHS Compliant: Yes; Max Operating Temperature: 85°C
D1 D2 = CMP-004-00040-2: as D6 on sheet OC_PROT; Source: rgled.SchLib; Component Type: Standard; Design Item ID: CMP-004-00034-2; Pins: 4
F1 F2 = CMP-07400-000017-1: Manufacturer Part Number: MF-PSMF010X-2; Manufacturer: Bourns Inc.; Resistance: 1-7.5Ω; Value: 1-7.5Ω; Current Rating: 40A; Hold Current: 0.1A; Trip Current: 0.3A; Voltage Rating: 15V; Trip Time: 1.5s; Temperature: -40°C to +85°C; ComponentLink2Description: Datasheet; Lead Free: Yes; Ipc Land Pattern Name: CAPC215135X67; Device Class L1: Circuit Protection; Mouser Description: Resettable Fuses - PPTC 0.10A 15V 1ohm; Automotive: No; Octopart: https://octopart.com/mf-psmf010x-2-bourns-7483441; RoHS: TRUE; Temperature Range High: +85°C; Digikey Description: PTC RESET FUSE 15V 100MA 0805; Device Class L3: unset; ComponentLink2URL: https://www.bourns.com/docs/Product-Datasheets/mfpsmf.pdf; Height: 0.85mm; Ambient Temperature Range Low: -40°C; Category: Fuse; Package: MF-PSMF; Temperature Range Low: -40°C; Device Class L2: PTC Resettable Fuses; Ambient Temperature Range High: +85°C
Q1 Q3 = CMP-013-00018-2: Trans MOSFET P-CH 20V 22.1A 8-Pin PowerPAK 1212 EP T/R; Source: SISH615ADN-T1-GE3.SchLib; Design Item ID: CMP-013-00036-4; Component Type: Standard; Pins: 5
Q2 = CMP-35916-000009-1: MOSFET 2N-CH 60V 0.3A; Input Capacitance: 40pF; Continuous Drain Current (ID): 300mA; Max Power Dissipation: 285mW; FET Type: 2 N-Channel; Rds On Max: 1.5R; Mount: Surface Mount; Drain to Source Voltage (Vdss): 60V; Packaging: Tape and Reel
R1-R20 = CMP-009-00002-14: Resistor
  R1 R3 R5 R7-R9 R11 R13 R15 R16: Value: 100k
  R2 R6 R10 R14: Value: 1k
  R4 R12: Value: 24k
  R17-R20: Value: 330
U1 U2 = CMP-1557-00001-1: Hall Effect Linear Current Sensor with Overcurrent Fault Output for <100 V Isolation Applications, 3 to 5.5 V, -15.5 to 15.5 A IP, -40 to 125 degC, 12-Pin QFN (EX), RoHS, Tape and Reel; VCC Max: 5.5 V; IP Max: 15.5 A; VCC Min: 3 V; IP Min: -15.5 A; -3dB Bandwidth: 0.1 MHz; PackageDescription: 12-Pin Quad Flat No-Lead, Body 3 x 3 mm, Height 0.8 mm; ComponentLink1URL: http://www.allegromicro.com/; Packing: Tape and Reel; ComponentLink2URL: http://www.allegromicro.com/~/media/Files/Datasheets/ACS711-Datasheet.ashx?la=en; DatasheetVersion: Rev. 3; PartNumber: ACS711KEXLT-15AB-T; ComponentLink2Description: Datasheet; ComponentLink3URL: http://www.allegromicro.com/~/media/Files/Datasheets/ACS711-Datasheet.ashx?la=en; RoHS: TRUE; ComponentLink1Description: Manufacturer URL; ComponentLink3Description: Package Specification; Temperature Max: 125 degC; Mounting Technology: Surface Mount; Temperature Min: -40 degC

## Sheet SENSOR_BANK.SchDoc
size A4; SheetNumber: 5; SheetTotal: 10
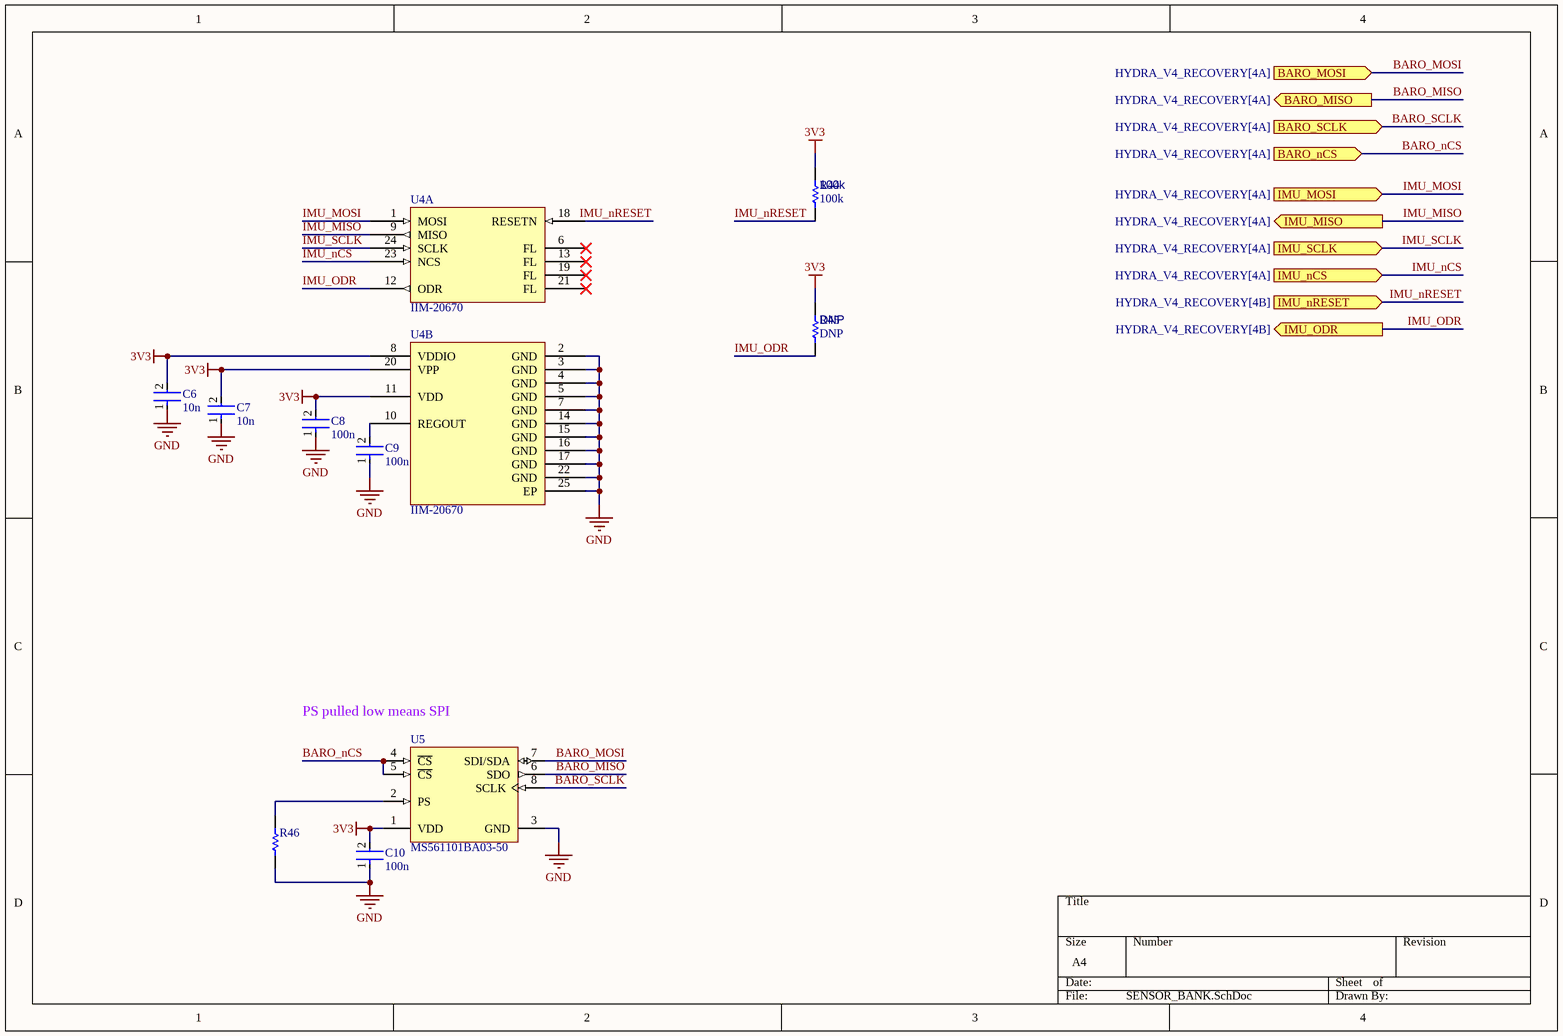
[diagram p5: SENSOR_BANK.SchDoc]

### Parts
C6  10n  [FP-0402-L_1_0_0_05-W_0_5-IPC_A]
C7  10n  [FP-0402-L_1_0_0_05-W_0_5-IPC_A]
C8  100n  [FP-0402-L_1_0_0_05-W_0_5-IPC_A]
C9  100n  [FP-0402-L_1_0_0_05-W_0_5-IPC_A]
C10  100n  [FP-0402-L_1_0_0_05-W_0_5-IPC_A]
R44  100k  [R0603B]
R45  DNP  [R0603B]
R46  0402 JUMPER  [RESC1005X40X25ML05T05]  (value not drawn)
U4  IIM-20670  [PQFN50P450X450X115_HS-25N]  (parts A,B of 2)
U5  MS561101BA03-50  [MSI-MS561101BA03-50-8_V]

### Ports
BARO_MISO (out, see HYDRA_V4_RECOVERY[4A]), BARO_MOSI (in, see HYDRA_V4_RECOVERY[4A]), BARO_nCS (in, see HYDRA_V4_RECOVERY[4A]), BARO_SCLK (in, see HYDRA_V4_RECOVERY[4A]), IMU_MISO (out, see HYDRA_V4_RECOVERY[4A]), IMU_MOSI (in, see HYDRA_V4_RECOVERY[4A]), IMU_nCS (in, see HYDRA_V4_RECOVERY[4A]), IMU_nRESET (in, see HYDRA_V4_RECOVERY[4B]), IMU_ODR (out, see HYDRA_V4_RECOVERY[4B]), IMU_SCLK (in, see HYDRA_V4_RECOVERY[4A])

### Nets
3V3: C6.2 C7.2 C8.2 C10.2 R44.2 R45.1 U4.8(VDDIO) U4.11(VDD) U4.20(VPP) U5.1(VDD)  [project net 3V3_OUT]
GND: C6.1 C7.1 C8.1 C9.1 C10.1 R46.1 U4.2(GND) U4.3(GND) U4.4(GND) U4.5(GND) U4.7(GND) U4.14(GND) U4.15(GND) U4.16(GND) U4.17(GND) U4.22(GND) U4.25(EP) U5.3(GND)
BARO_MISO: U4.9(MISO) U5.6(SDO) ; port IMU_MISO, port BARO_MISO  [also labelled IMU_MISO]
BARO_MOSI: U4.1(MOSI) U5.7(SDI/SDA) ; port IMU_MOSI, port BARO_MOSI  [also labelled IMU_MOSI]
BARO_nCS: U5.4(~{CS}) U5.5(~{CS}) ; port BARO_nCS
BARO_SCLK: U4.24(SCLK) U5.8(SCLK) ; port BARO_SCLK, port IMU_SCLK  [also labelled IMU_SCLK]
IMU_nCS: U4.23(NCS) ; port IMU_nCS
IMU_nRESET: R44.1 U4.18(RESETN) ; port IMU_nRESET
IMU_ODR: R45.2 U4.12(ODR) ; port IMU_ODR
NetC9_2: C9.2 U4.10(REGOUT)
NetR46_2: R46.2 U5.2(PS)

Not connected (* = marked no-connect by the designer): U4 6(FL)* 13(FL)* 19(FL)* 21(FL)*

### Notes on the sheet
- (near U5) PS pulled low means SPI

### Library data of the parts
C6-C10 = CMP-001-00058-1: as C3 on sheet OC_PROT; Min Operating Temperature: -55°C; Mounting Technology: Surface Mount; Pins: 2; Case/Package: 0402; RoHS Compliant: Yes; Max Operating Temperature: 85°C
  C6 C7: Value: 10n
  C8-C10: Value: 100n
R44 R45 = CMP-009-00002-14: Resistor
  R44: Value: 100k
  R45: Value: DNP
R46 = CMP-009-00118-2: READ THE NAME; Pins: 2; Component Type: Standard; Design Item ID: CMP-009-00206-2; Source: 0402jump.SchLib; Value: 0402 JUMPER
U4 = CMP-010-00029-4: 6-axis IMU with extended temperature range and high VRE performance
U5 = CMP-2000-05251-1: Barometric Pressure Sensor, with Stainless Steel Cap, 1.8 to 3.6 V, -45 to 85 degC, 8-Pin QFN, RoHS, Tape and Reel; Manufacturer: Measurement Specialties; Operating Pressure Max: 1200mbar; Supply Current: 12.5µA; Supply Voltage Max: 3.6V; Supply Voltage Min: 1.8V; No. of Pins: 8; Connection Size: 0.5mm; SVHC: NoSVHC(20-Jun-2013); Operating Pressure Min: 10mbar; Manufacturer URL: http://www.meas-spec.com/; Operating Temperature Min: -40degC; Pressure Type: Barometric; Package Reference: MS561101BA03-50-8; Datasheet URL: http://www.te.com/commerce/DocumentDelivery/DDEController?Action=srchrtrv&DocNm=MS5611-01BA03&DocType=Data+Sheet&DocLang=English&DocFormat=pdf&PartCntxt=CAT-BLPS0036; Package Description: 8-Pin Surface Mount Device, Body 5 x 3 mm, Pitch 1.25 mm; Sensor Case Style: QFN; Datasheet Version: Sep-15; Operating Temperature Max: 85degC

## Sheet CAMERA_INTERFACE.SchDoc
size B; SheetNumber: 6; SheetTotal: 10
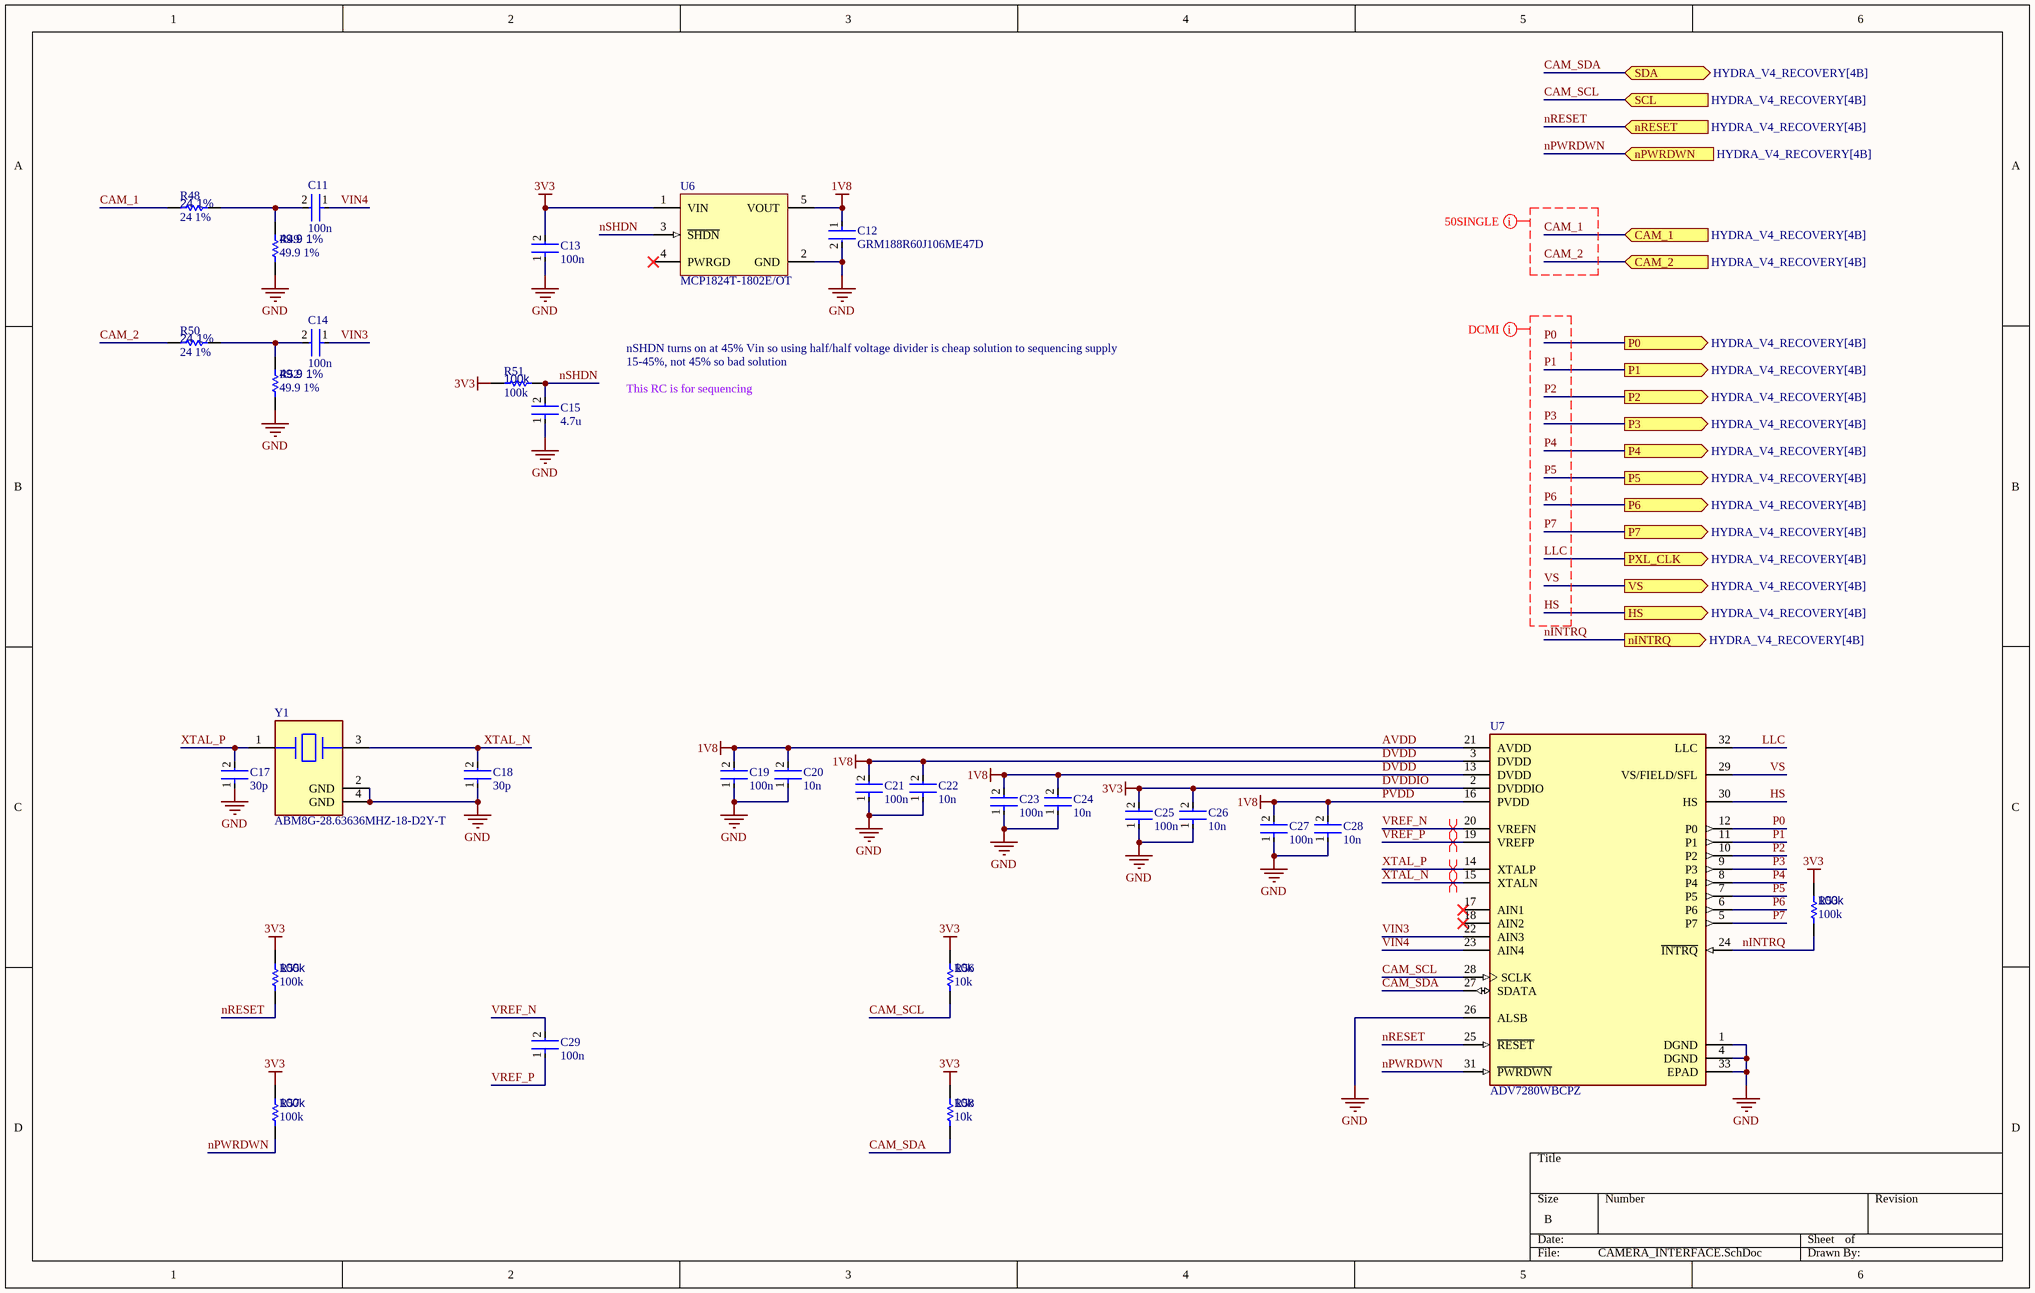
[diagram p6: CAMERA_INTERFACE.SchDoc]

### Parts
C11  100n  [FP-0402-L_1_0_0_05-W_0_5-IPC_A]
C12  GRM188R60J106ME47D  [FP-GRM188-0_1-e0_2_0_55-IPC_A]
C13  100n  [FP-0402-L_1_0_0_05-W_0_5-IPC_A]
C14  100n  [FP-0402-L_1_0_0_05-W_0_5-IPC_A]
C15  4.7u  [FP-0402-L_1_0_0_05-W_0_5-IPC_A]
C17  30p  [FP-0402-L_1_0_0_05-W_0_5-IPC_A]
C18  30p  [FP-0402-L_1_0_0_05-W_0_5-IPC_A]
C19  100n  [FP-0402-L_1_0_0_05-W_0_5-IPC_A]
C20  10n  [FP-0402-L_1_0_0_05-W_0_5-IPC_A]
C21  100n  [FP-0402-L_1_0_0_05-W_0_5-IPC_A]
C22  10n  [FP-0402-L_1_0_0_05-W_0_5-IPC_A]
C23  100n  [FP-0402-L_1_0_0_05-W_0_5-IPC_A]
C24  10n  [FP-0402-L_1_0_0_05-W_0_5-IPC_A]
C25  100n  [FP-0402-L_1_0_0_05-W_0_5-IPC_A]
C26  10n  [FP-0402-L_1_0_0_05-W_0_5-IPC_A]
C27  100n  [FP-0402-L_1_0_0_05-W_0_5-IPC_A]
C28  10n  [FP-0402-L_1_0_0_05-W_0_5-IPC_A]
C29  100n  [FP-0402-L_1_0_0_05-W_0_5-IPC_A]
R48  24 1%  [R0603B]
R49  49.9 1%  [R0603B]
R50  24 1%  [R0603B]
R51  100k  [R0603B]
R52  49.9 1%  [R0603B]
R53  100k  [R0603B]
R55  100k  [R0603B]
R56  10k  [R0603B]
R57  100k  [R0603B]
R58  10k  [R0603B]
U6  MCP1824T-1802E/OT  [SOT-23-OT5_M]
U7  ADV7280WBCPZ  [FP-CP-32-12-MFG]
Y1  ABM8G-28.63636MHZ-18-D2Y-T  [FP-ABM8G-MFG]

### Ports
CAM_1 (in, see HYDRA_V4_RECOVERY[4B]), CAM_2 (in, see HYDRA_V4_RECOVERY[4B]), HS (out, see HYDRA_V4_RECOVERY[4B]), nINTRQ (out, see HYDRA_V4_RECOVERY[4B]), nPWRDWN (in, see HYDRA_V4_RECOVERY[4B]), nRESET (in, see HYDRA_V4_RECOVERY[4B]), P0 (out, see HYDRA_V4_RECOVERY[4B]), P1 (out, see HYDRA_V4_RECOVERY[4B]), P2 (out, see HYDRA_V4_RECOVERY[4B]), P3 (out, see HYDRA_V4_RECOVERY[4B]), P4 (out, see HYDRA_V4_RECOVERY[4B]), P5 (out, see HYDRA_V4_RECOVERY[4B]), P6 (out, see HYDRA_V4_RECOVERY[4B]), P7 (out, see HYDRA_V4_RECOVERY[4B]), PXL_CLK (out, see HYDRA_V4_RECOVERY[4B]), SCL (in, see HYDRA_V4_RECOVERY[4B]), SDA (bidir, see HYDRA_V4_RECOVERY[4B]), VS (out, see HYDRA_V4_RECOVERY[4B])

### Nets
3V3: C13.2 C25.2 C26.2 R51.2 R53.1 R55.1 R56.1 R57.1 R58.1 U6.1(VIN) U7.2(DVDDIO)  [also labelled DVDDIO]  [project net 3V3_OUT]
AVDD: C12.1 C19.2 C20.2 C21.2 C22.2 C23.2 C24.2 C27.2 C28.2 U6.5(VOUT) U7.3(DVDD) U7.13(DVDD) U7.16(PVDD) U7.21(AVDD)  [also labelled 1V8, DVDD, PVDD]
GND: C12.2 C13.1 C15.1 C17.1 C18.1 C19.1 C20.1 C21.1 C22.1 C23.1 C24.1 C25.1 C26.1 C27.1 C28.1 R49.1 R52.1 U6.2(GND) U7.1(DGND) U7.4(DGND) U7.26(ALSB) U7.33(EPAD) Y1.2(GND) Y1.4(GND)
CAM_1: R48.2 ; port CAM_1
CAM_2: R50.2 ; port CAM_2
CAM_SCL: R56.2 U7.28(SCLK) ; port SCL
CAM_SDA: R58.2 U7.27(SDATA) ; port SDA
HS: U7.30(HS) ; port HS
LLC: U7.32(LLC) ; port PXL_CLK
nINTRQ: R53.2 U7.24(~{INTRQ}) ; port nINTRQ
nPWRDWN: R57.2 U7.31(~{PWRDWN}) ; port nPWRDWN
nRESET: R55.2 U7.25(~{RESET}) ; port nRESET
nSHDN: C15.2 R51.1 U6.3(~{SHDN})
P0: U7.12(P0) ; port P0
P1: U7.11(P1) ; port P1
P2: U7.10(P2) ; port P2
P3: U7.9(P3) ; port P3
P4: U7.8(P4) ; port P4
P5: U7.7(P5) ; port P5
P6: U7.6(P6) ; port P6
P7: U7.5(P7) ; port P7
VIN3: C14.1 U7.22(AIN3)
VIN4: C11.1 U7.23(AIN4)
VREF_N: C29.2 U7.20(VREFN)
VREF_P: C29.1 U7.19(VREFP)
VS: U7.29(VS/FIELD/SFL) ; port VS
XTAL_N: C18.2 U7.15(XTALN) Y1.3
XTAL_P: C17.2 U7.14(XTALP) Y1.1
NetC11_2: C11.2 R48.1 R49.2
NetC14_2: C14.2 R50.1 R52.2

Not connected (* = marked no-connect by the designer): U6 4(PWRGD)*; U7 17(AIN1)* 18(AIN2)*

### Layout directives
differential pair: VREF_N, VREF_P, XTAL_N, XTAL_P
net class DCMI: HS, LLC, P0, P1, P2, P3, P4, P5, P6, P7, VS
net class 50SINGLE: CAM_1, CAM_2

### Notes on the sheet
- nSHDN turns on at 45% Vin so using half/half voltage divider is cheap solution to sequencing supply
- 15-45%, not 45% so bad solution
- This RC is for sequencing

### Library data of the parts
C11 C13-C15 C17-C29 = CMP-001-00058-1: as C3 on sheet OC_PROT; Min Operating Temperature: -55°C; Mounting Technology: Surface Mount; Pins: 2; Case/Package: 0402; RoHS Compliant: Yes; Max Operating Temperature: 85°C
  C11 C13 C14 C19 C21 C23 C25 C27 C29: Value: 100n
  C15: Value: 4.7u
  C17 C18: Value: 30p
  C20 C22 C24 C26 C28: Value: 10n
C12 = CMP-2006-02792-2: Chip Multilayer Ceramic Capacitors for General Purpose, 0603, 10uF, X5R, 15%, 20%, 6.3V; Packaging: Tape and Reel; Voltage Rating (DC): 6.3V; Width: 0.031inch; Termination: SMD/SMT; Dielectric: X5R; Package Quantity: 4000; Voltage Rating: 6.3V; Capacitance: 10uF; Case/Package: 0603; Min Operating Temperature: -55°C; Voltage: 6.3V; Length: 1.6mm; Thickness: 0.035inch; Lead Free: Lead Free; Depth: 0.8mm; Case Code (Imperial): 0603; Max Operating Temperature: 85°C; Material: Ceramic; Height: 0.8mm; Tolerance: 20%; Mount: Surface Mount; REACH SVHC: No SVHC; Radiation Hardening: No; Case Code (Metric): 1608; Value: GRM188R60J106ME47D
R48-R53 R55-R58 = CMP-009-00002-14: Resistor
  R48 R50: Value: 24 1%
  R49 R52: Value: 49.9 1%
  R51 R53 R55 R57: Value: 100k
  R56 R58: Value: 10k
U6 = CMP-0136-00652-1: 300 mA, Low Voltage, Low Quiescent Current LDO Regulator, 5-Pin SOT-23, Extended Temperature, Tape and Reel; DatasheetVersion: revA, Aug-2007; PackageDescription: 5-Lead Plastic Small Outline Transistor (OT) [SOT-23]; Code_IPC: SOT23-5; PackageReference: SOT-23-OT5; PackageVersion: revBB, Aug-2009
U7 = CMP-015-00015-1: Color Signal Decoder, CMOS; Max Operating Temperature: 105°C; RoHS Compliant: Yes; Min Operating Temperature: -40°C; Pins: 32
Y1 = CMP-27762-014063-1: Crystal 28.63636MHz ±20ppm (Tol) ±30ppm (Stability) 18pF FUND 50Ω 4-Pin SMD T/R; ESR (Equivalent Series Resistance): 50R; Operating Frequency: 28.6 MHz; Length: 3.2mm; Lead Free: Lead Free; Width: 2.5mm; Termination: SMD/SMT; Series: ABM8G; Max Operating Temperature: 85°C; REACH SVHC: Yes; Mount: Surface Mount; Case/Package: SMD/SMT; Frequency Tolerance: 20ppm; Number of Pins: 4; Load Capacitance: 18pF; Tolerance: 20ppm; Series Resistance: 50R; Height: 1mm; Frequency: 28.63636MHz; Min Operating Temperature: -40°C; Frequency Stability: 30ppm; Package Quantity: 1000; Packaging: Tape and Reel; Radiation Hardening: No

## Sheet TCAN330_PINOUT.SchDoc
size A4; SheetNumber: 8; SheetTotal: 10
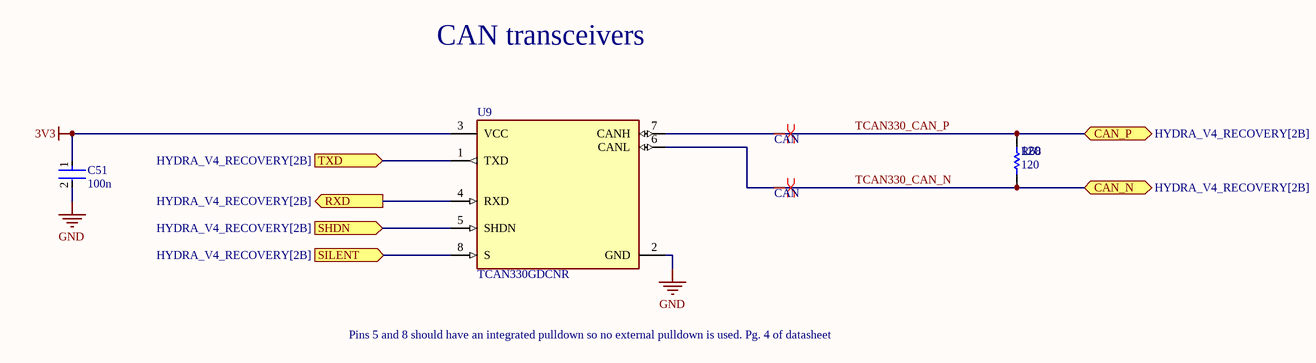
[diagram p7: TCAN330_PINOUT.SchDoc]

### Parts
C51  100n  [FP-0402-L_1_0_0_05-W_0_5-IPC_A]
R68  120  [R0603B]
U9  TCAN330GDCNR  [FP-DCN0008A-MFG]

### Ports
CAN_N (bidir, see HYDRA_V4_RECOVERY[2B]), CAN_P (bidir, see HYDRA_V4_RECOVERY[2B]), RXD (out, see HYDRA_V4_RECOVERY[2B]), SHDN (in, see HYDRA_V4_RECOVERY[2B]), SILENT (in, see HYDRA_V4_RECOVERY[2B]), TXD (in, see HYDRA_V4_RECOVERY[2B])

### Nets
3V3: C51.1 U9.3(VCC)  [project net 3V3_OUT]
GND: C51.2 U9.2(GND)
TCAN330_CAN_N: R68.1 U9.6(CANL) ; port CAN_N  [project net CAN1_N]
TCAN330_CAN_P: R68.2 U9.7(CANH) ; port CAN_P  [project net CAN1_P]
NetU8_70: U9.4(RXD) ; port RXD
NetU8_71: U9.1(TXD) ; port TXD
NetU9_5: U9.5(SHDN) ; port SHDN
NetU9_8: U9.8(S) ; port SILENT

### Layout directives
differential pair; net class CAN: CAN1_N, CAN1_P

### Notes on the sheet
- CAN transceivers
- Pins 5 and 8 should have an integrated pulldown so no external pulldown is used. Pg. 4 of datasheet

### Library data of the parts
C51 = CMP-001-00058-1: as C3 on sheet OC_PROT; Value: 100n; Min Operating Temperature: -55°C; Mounting Technology: Surface Mount; Pins: 2; Case/Package: 0402; RoHS Compliant: Yes; Max Operating Temperature: 85°C
R68 = CMP-009-00002-14: Resistor; Value: 120
U9 = CMP-04872-000178-1: IC TRANSCEIVER 1/1 SOT23-8; Data Rate: 1Mbps; Packaging: Tape and Reel; Min Operating Temperature: -40°C; Max Operating Temperature: 125°C; RoHS Compliant: Yes; Lead Free: Lead Free; Case/Package: SOT-23-8; Mount: Surface Mount

## Sheet TCAN1146_PINOUT.SchDoc
size A4; SheetNumber: 9; SheetTotal: 10
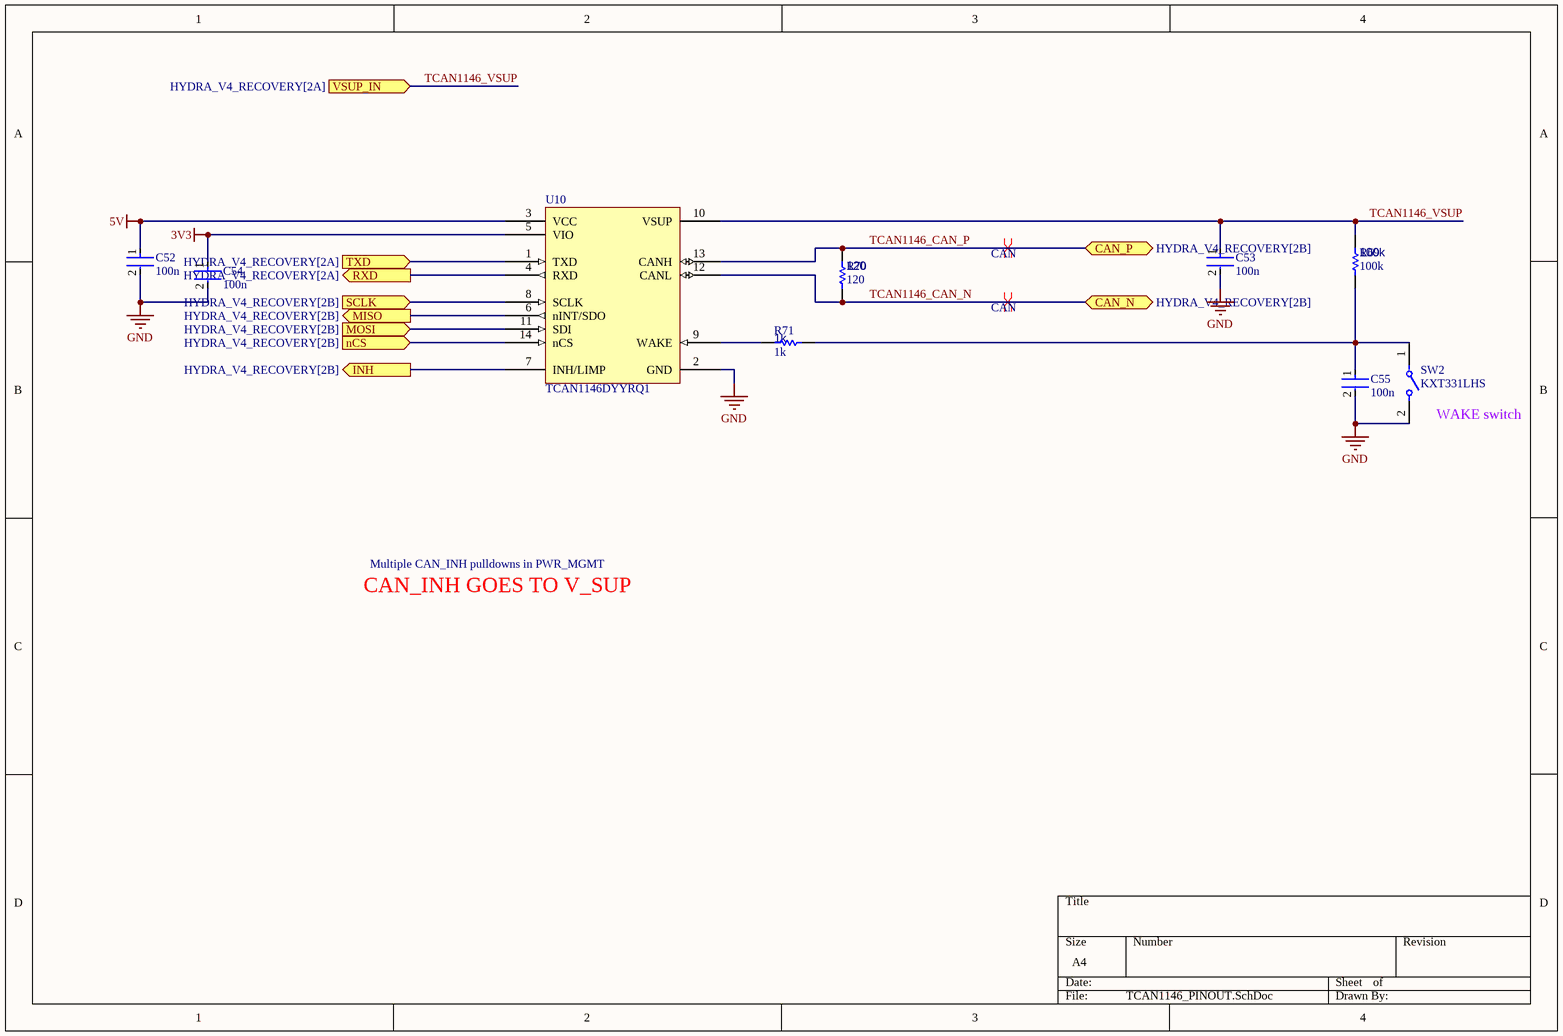
[diagram p8: TCAN1146_PINOUT.SchDoc]

### Parts
C52  100n  [FP-0402-L_1_0_0_05-W_0_5-IPC_A]
C53  100n  [FP-0402-L_1_0_0_05-W_0_5-IPC_A]
C54  100n  [FP-0402-L_1_0_0_05-W_0_5-IPC_A]
C55  100n  [FP-0402-L_1_0_0_05-W_0_5-IPC_A]
R69  100k  [R0603B]
R70  120  [R0603B]
R71  1k  [R0603B]
SW2  KXT331LHS  [FP-KXT331LHS-MFG]
U10  TCAN1146DYYRQ1  [TCAN1146DYYRQ1-Footprint-1]

### Ports
CAN_N (bidir, see HYDRA_V4_RECOVERY[2B]), CAN_P (bidir, see HYDRA_V4_RECOVERY[2B]), INH (out, see HYDRA_V4_RECOVERY[2B]), MISO (out, see HYDRA_V4_RECOVERY[2B]), MOSI (in, see HYDRA_V4_RECOVERY[2B]), nCS (in, see HYDRA_V4_RECOVERY[2B]), RXD (out, see HYDRA_V4_RECOVERY[2A]), SCLK (in, see HYDRA_V4_RECOVERY[2B]), TXD (in, see HYDRA_V4_RECOVERY[2A]), VSUP_IN (in, see HYDRA_V4_RECOVERY[2A])

### Nets
3V3: C54.1 U10.5(VIO)  [project net 3V3_OUT]
5V: C52.1 U10.3(VCC)
GND: C52.2 C53.2 C54.2 C55.2 SW2.2 U10.2(GND)
TCAN1146_VSUP: C53.1 R69.2 U10.10(VSUP) ; port VSUP_IN
PRE_ZENER_CAN_INH: U10.7(INH/LIMP) ; port INH
TCAN1146_CAN_N: R70.1 U10.12(CANL) ; port CAN_N  [project net CAN0_N]
TCAN1146_CAN_P: R70.2 U10.13(CANH) ; port CAN_P  [project net CAN0_P]
NetC55_1: C55.1 R69.1 R71.1 SW2.1
NetR71_2: R71.2 U10.9(WAKE)
NetU8_16: U10.11(SDI) ; port MOSI
NetU8_17: U10.6(nINT/SDO) ; port MISO
NetU8_51: U10.14(nCS) ; port nCS
NetU8_52: U10.8(SCLK) ; port SCLK
NetU8_59: U10.4(RXD) ; port RXD
NetU8_60: U10.1(TXD) ; port TXD

### Layout directives
differential pair; differential pair class CAN: CAN0_N, CAN0_P

### Notes on the sheet
- (near SW2) WAKE switch
- Multiple CAN_INH pulldowns in PWR_MGMT
- CAN_INH GOES TO V_SUP

### Library data of the parts
C52-C55 = CMP-001-00058-1: as C3 on sheet OC_PROT; Value: 100n; Min Operating Temperature: -55°C; Mounting Technology: Surface Mount; Pins: 2; Case/Package: 0402; RoHS Compliant: Yes; Max Operating Temperature: 85°C
R69-R71 = CMP-009-00002-14: Resistor
  R69: Value: 100k
  R70: Value: 120
  R71: Value: 1k
SW2 = CMP-10040-000029-1: as SW1 on sheet STM32H730_PINOUT; Contact Plating: Gold; Insulation Color: Black; Min Operating Temperature: -40°C; Packaging: Tape and Reel; Flammability Rating: UL94 V-0; Max Operating Temperature: 85°C; Termination: Solder; Mount: Surface Mount
U10 = CMP-318-000000-2: Automotive CAN FD transceiver with watchdog, bus diagnostics and partial networking via sele 14-SOT-23-THIN -40 to 150; Component Type: Standard; Design Item ID: CMP-015-00012-2; Pin Count: 14; Source: TCAN1146DYYRQ1.SchLib